# Altium project S6_FLHS_A2D-pcb-AW1.PrjPcb (part 3 of 3)

## Sheet Power-AW1.SchDoc
size E; SheetNumber: 2; SheetTotal: 5
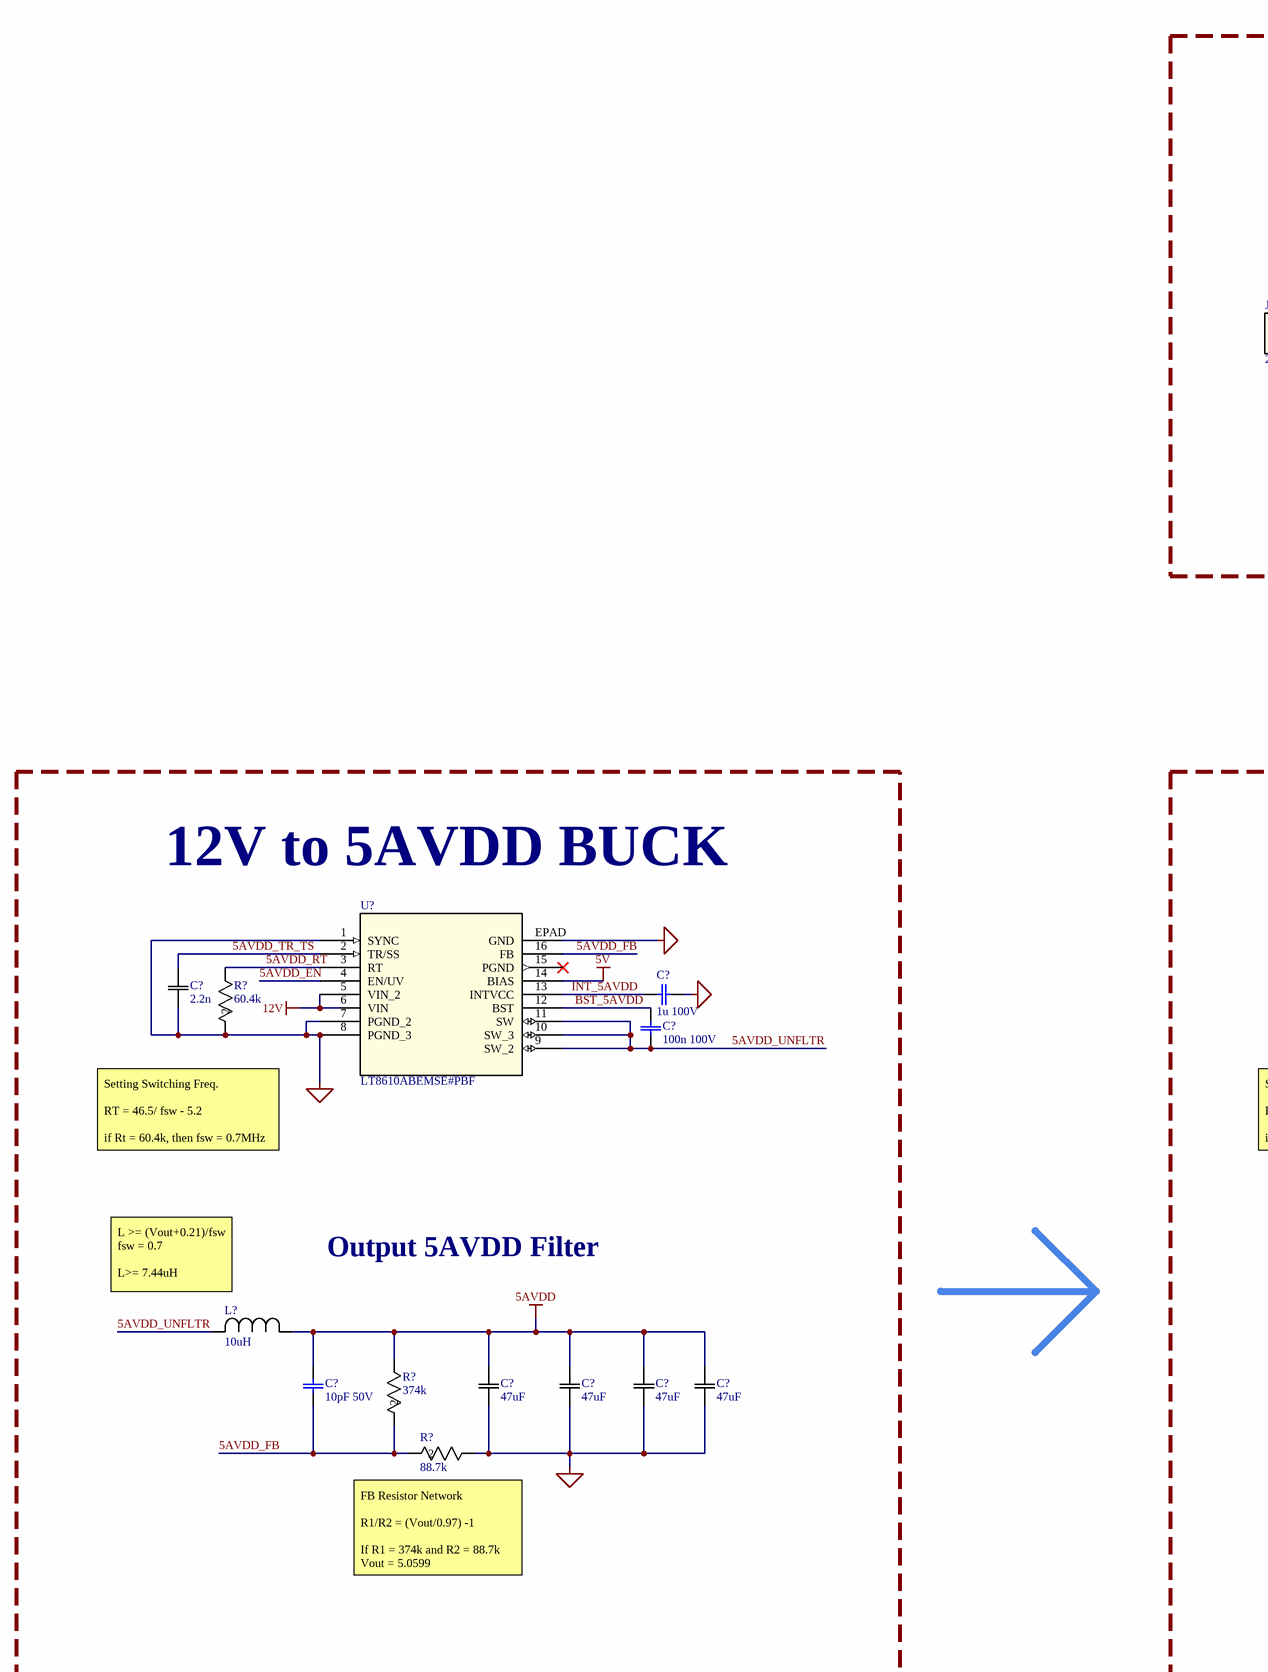
[diagram p3: Power-AW1.SchDoc, top middle]
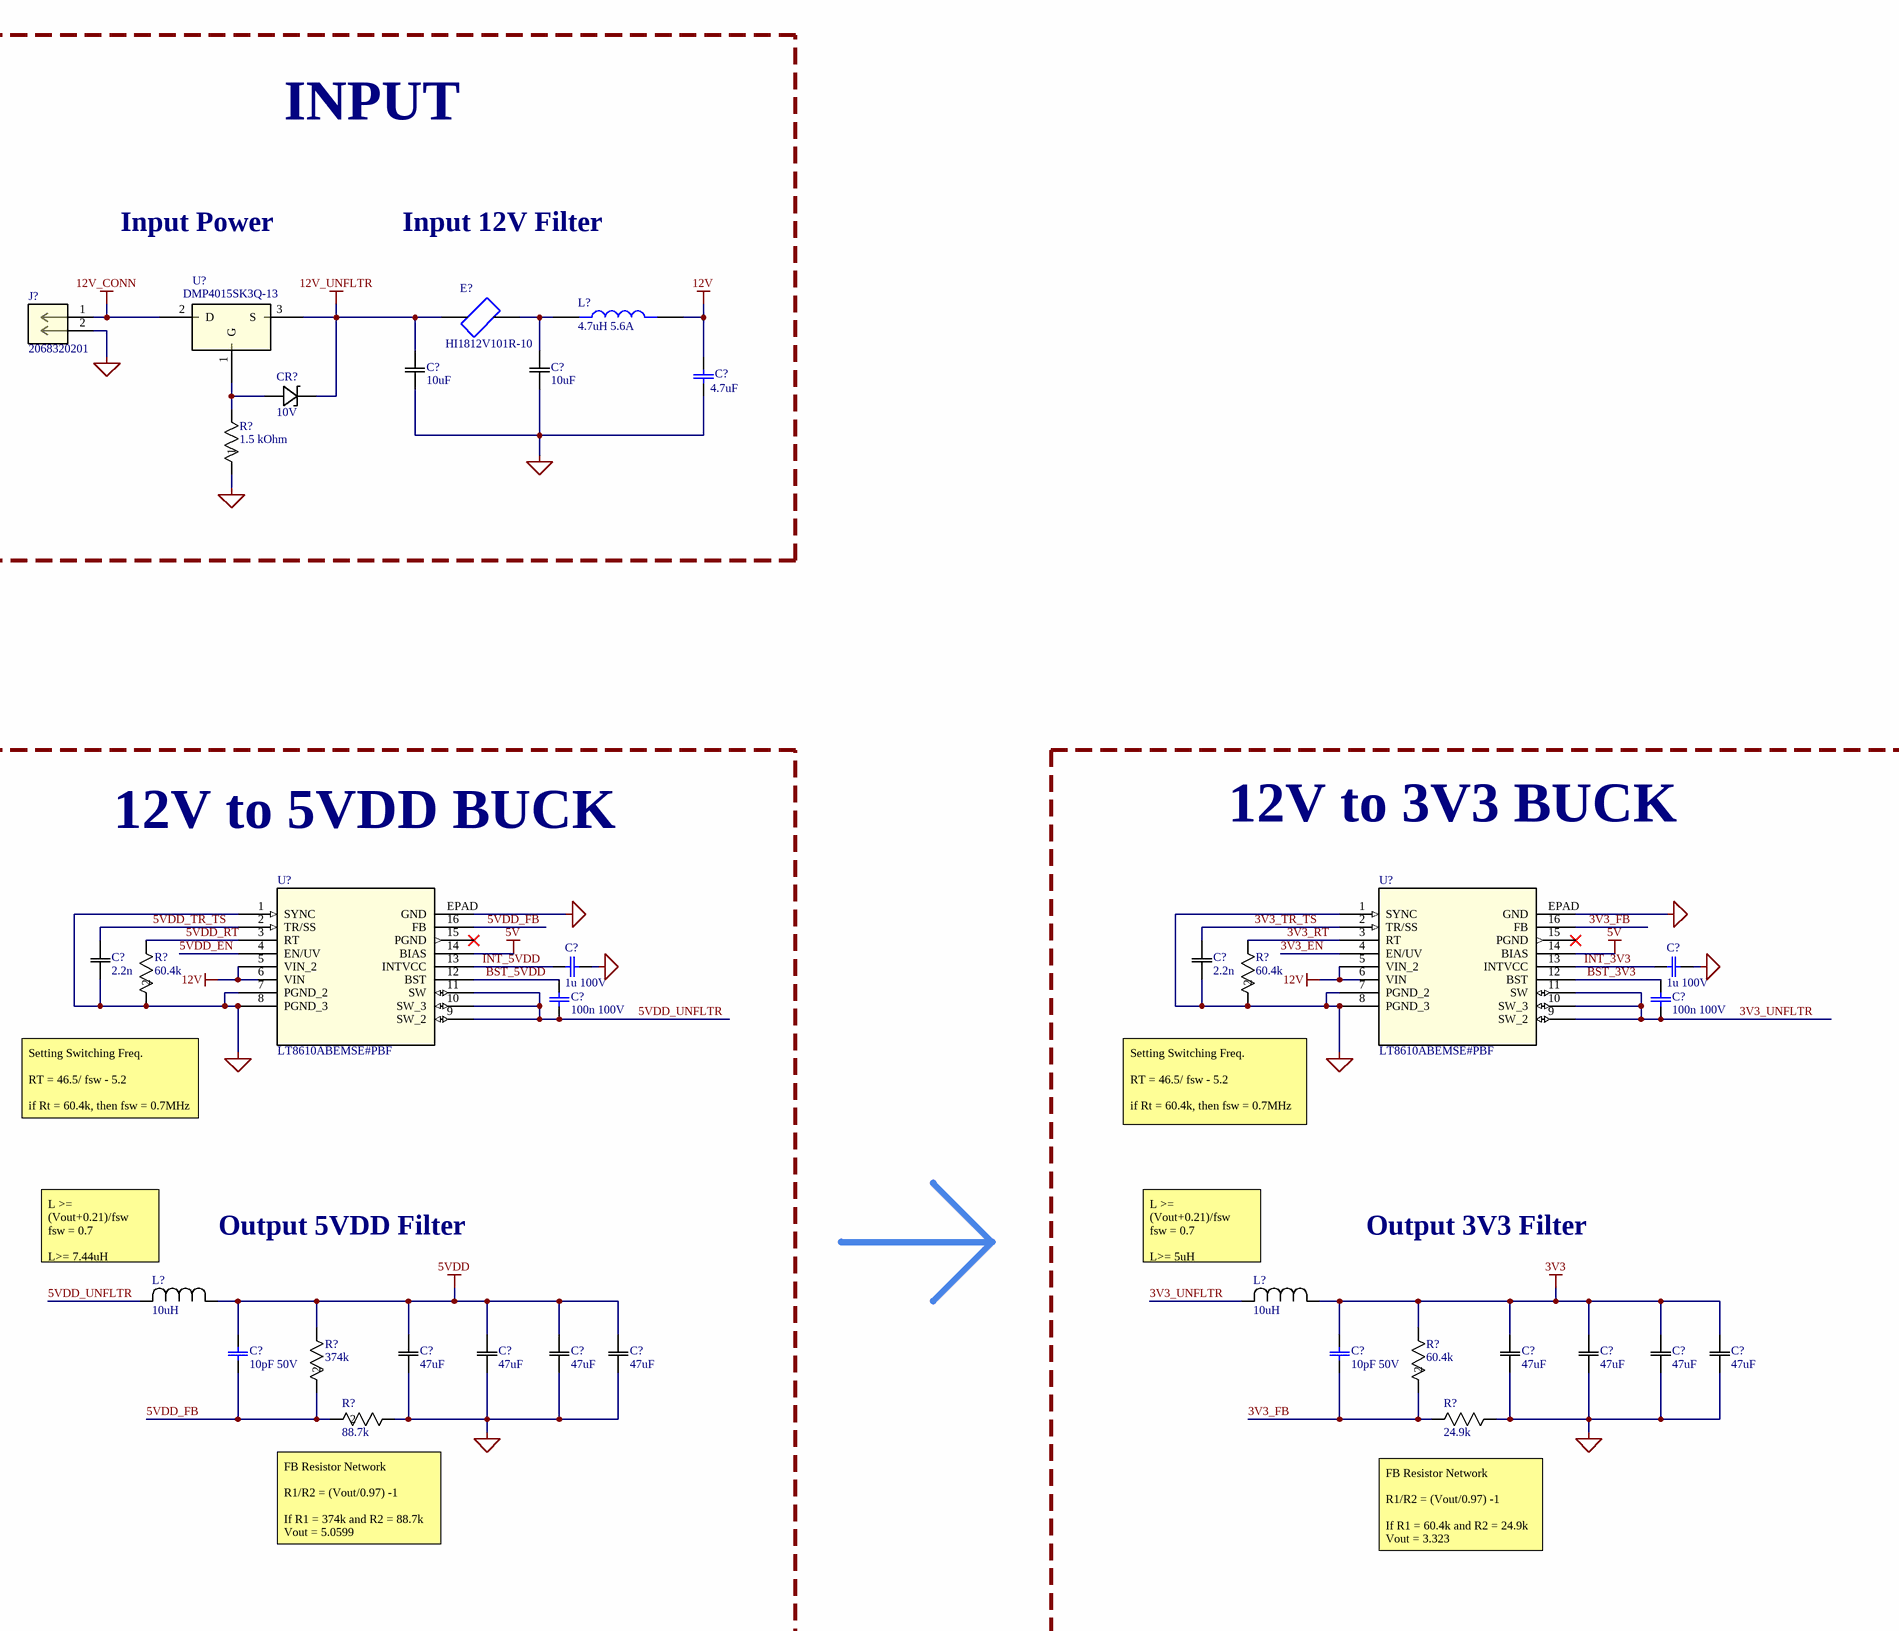
[diagram p4: Power-AW1.SchDoc, top right]
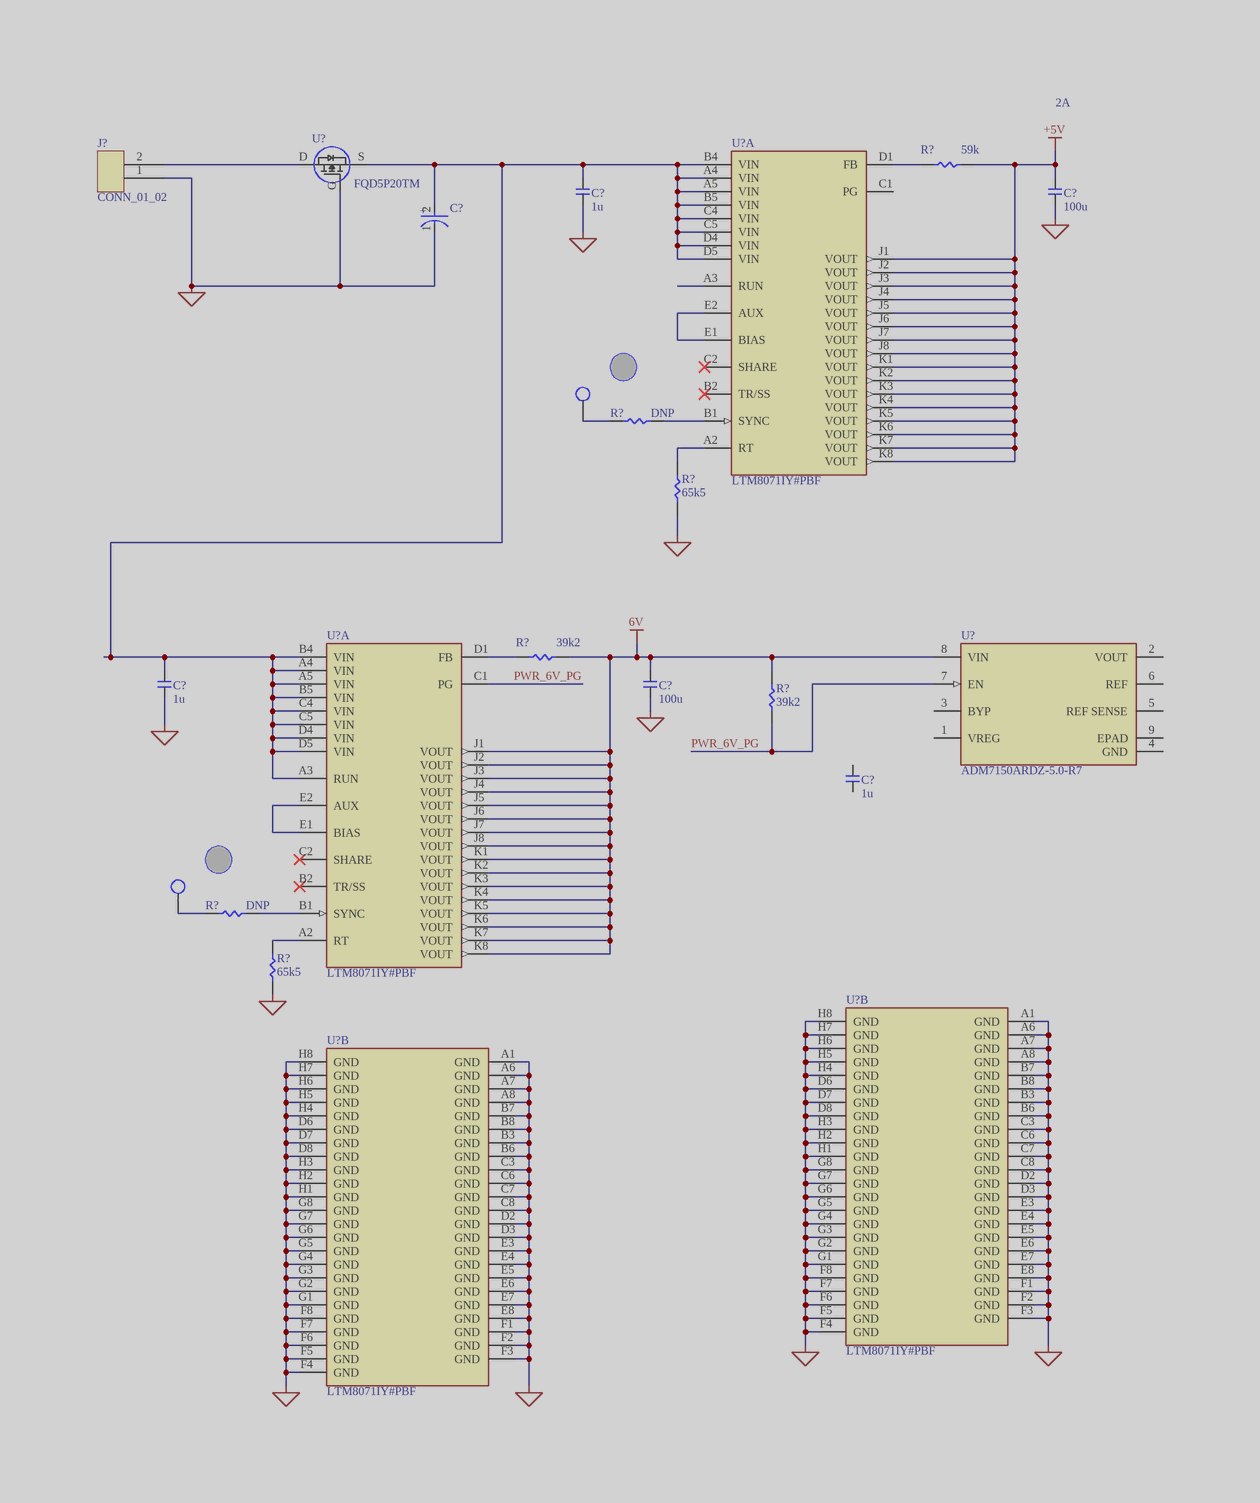
[diagram p5: Power-AW1.SchDoc, bottom left]
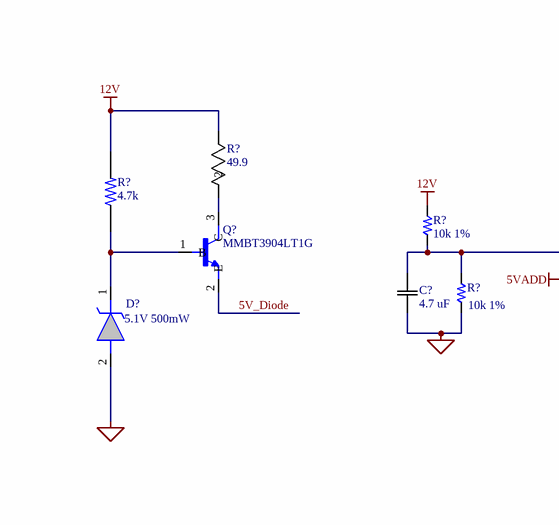
[diagram p6: Power-AW1.SchDoc, bottom middle]
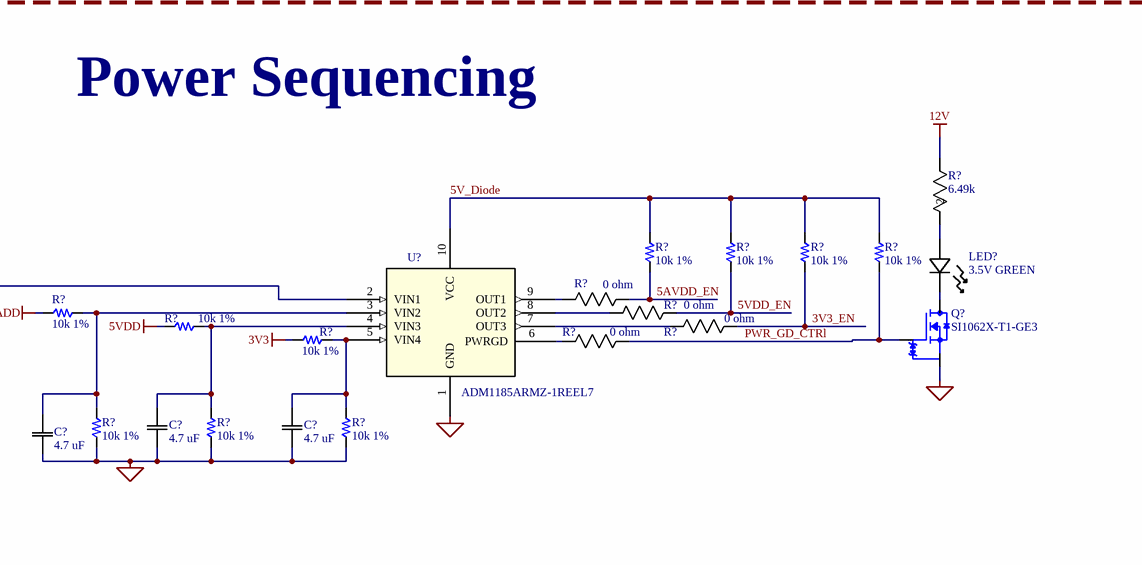
[diagram p7: Power-AW1.SchDoc, bottom right]

### Parts
(Parts that share a designator on the sheet are numbered #1, #2 ... from top to bottom, then left to right.)
C?#1  10uF  [CAP_C225-1210_TDK]
C?#2  10uF  [CAP_C225-1210_TDK]
C?#3  CL31B475KBHVPNE  [CL31B475KBHVPNE]  (value not drawn)
C?#4  1u 100V  [CL31B105KCHNNNE]
C?#5  1u 100V  [CL31B105KCHNNNE]
C?#6  1u 100V  [CL31B105KCHNNNE]
C?#7  2.2n  [CAP_CL21_SAM]
C?#8  2.2n  [CAP_CL21_SAM]
C?#9  2.2n  [CAP_CL21_SAM]
C?#10  100n 100V  [CL31B104KCFNNNE]
C?#11  100n 100V  [CL31B104KCFNNNE]
C?#12  100n 100V  [CL31B104KCFNNNE]
C?#13  10pF 50V  [CL10C100CB81PNC]
C?#14  47uF  [CAP_CL32B_SAM]
C?#15  47uF  [CAP_CL32B_SAM]
C?#16  47uF  [CAP_CL32B_SAM]
C?#17  47uF  [CAP_CL32B_SAM]
C?#18  10pF 50V  [CL10C100CB81PNC]
C?#19  47uF  [CAP_CL32B_SAM]
C?#20  47uF  [CAP_CL32B_SAM]
C?#21  47uF  [CAP_CL32B_SAM]
C?#22  47uF  [CAP_CL32B_SAM]
C?#23  10pF 50V  [CL10C100CB81PNC]
C?#24  47uF  [CAP_CL32B_SAM]
C?#25  47uF  [CAP_CL32B_SAM]
C?#26  47uF  [CAP_CL32B_SAM]
C?#27  47uF  [CAP_CL32B_SAM]
C?#28  1u  [CAP_1206]  (masked out: inside a compile mask, not in the netlist)
C?#29  100u  [CAP_1206]  (masked out: inside a compile mask, not in the netlist)
C?#30  T521X107M025ATE060  [FP-T521X-MFG]  (value not drawn)  (masked out: inside a compile mask, not in the netlist)
C?#31  4.7 uF  [CAP_GRM188D_MUR]
C?#32  4.7 uF  [CAP_GRM188D_MUR]
C?#33  4.7 uF  [CAP_GRM188D_MUR]
C?#34  1u  [CAP_1206]  (masked out: inside a compile mask, not in the netlist)
C?#35  100u  [CAP_1206]  (masked out: inside a compile mask, not in the netlist)
C?#36  4.7 uF  [CAP_GRM188D_MUR]
C?#37  1u  [CAP_1206]  (masked out: inside a compile mask, not in the netlist)
CR?  10V  [ZDO_SOF523_BZT52C_DIO-M]
D?  5.1V 500mW  [SOD3716X145N]
E?  HI1812V101R-10  [FB_HI1812V101R-10]
J?#1  2068320201  [CONN_2068320000-SD_02_MOL]
J?#2  CONN_01_02  (masked out: inside a compile mask, not in the netlist)
L?#1  4.7uH 5.6A  [IND_SPM6530T-4R7M]
L?#2  10uH  [IND_IHLP_2525_CZ_VIS]
L?#3  10uH  [IND_IHLP_2525_CZ_VIS]
L?#4  10uH  [IND_IHLP_2525_CZ_VIS]
LED?  3.5V GREEN  [Lite_on_LED]
Q?#1  MMBT3904LT1G  [SOT95P240X111-3N]
Q?#2  SI1062X-T1-GE3  [SOT50P160X80-3N]
R?#1  1.5 kOhm  [RES_CRCW0402_VIS-m]
R?#2  60.4k  [RC0805N_YAG]
R?#3  60.4k  [RC0805N_YAG]
R?#4  60.4k  [RC0805N_YAG]
R?#5  374k  [RC0805N_YAG]
R?#6  374k  [RC0805N_YAG]
R?#7  60.4k  [RC0805N_YAG]
R?#8  88.7k  [RC0805N_YAG]
R?#9  88.7k  [RC0805N_YAG]
R?#10  24.9k  [RC0603N_YAG-M]
R?#11  59k  [RES_0402]  (masked out: inside a compile mask, not in the netlist)
R?#12  DNP  [RES_0402]  (net tie, no BOM)  (masked out: inside a compile mask, not in the netlist)
R?#13  4.7k  [RESC1607X60N]
R?#14  6.49k  [RC0603N_PAN-M]
R?#15  49.9  [RC0603N_PAN-M]
R?#16  65k5  [RES_0402]  (masked out: inside a compile mask, not in the netlist)
R?#17  value 10k 1%  [ERJ-3EKF1002V]  (hidden comment: ERJ-3EKF1002V)
R?#18  value 10k 1%  [ERJ-3EKF1002V]  (hidden comment: ERJ-3EKF1002V)
R?#19  value 10k 1%  [ERJ-3EKF1002V]  (hidden comment: ERJ-3EKF1002V)
R?#20  value 10k 1%  [ERJ-3EKF1002V]  (hidden comment: ERJ-3EKF1002V)
R?#21  value 10k 1%  [ERJ-3EKF1002V]  (hidden comment: ERJ-3EKF1002V)
R?#22  0 ohm  [RC0402N_PAN-M]
R?#23  value 10k 1%  [ERJ-3EKF1002V]  (hidden comment: ERJ-3EKF1002V)
R?#24  0 ohm  [RC0402N_PAN-M]
R?#25  value 10k 1%  [ERJ-3EKF1002V]  (hidden comment: ERJ-3EKF1002V)
R?#26  0 ohm  [RC0402N_PAN-M]
R?#27  value 10k 1%  [ERJ-3EKF1002V]  (hidden comment: ERJ-3EKF1002V)
R?#28  0 ohm  [RC0402N_PAN-M]
R?#29  value 10k 1%  [ERJ-3EKF1002V]  (hidden comment: ERJ-3EKF1002V)
R?#30  39k2  [RES_0402]  (masked out: inside a compile mask, not in the netlist)
R?#31  value 10k 1%  [ERJ-3EKF1002V]  (hidden comment: ERJ-3EKF1002V)
R?#32  value 10k 1%  [ERJ-3EKF1002V]  (hidden comment: ERJ-3EKF1002V)
R?#33  value 10k 1%  [ERJ-3EKF1002V]  (hidden comment: ERJ-3EKF1002V)
R?#34  39k2  [RES_0402]  (masked out: inside a compile mask, not in the netlist)
R?#35  DNP  [RES_0402]  (net tie, no BOM)  (masked out: inside a compile mask, not in the netlist)
R?#36  65k5  [RES_0402]  (masked out: inside a compile mask, not in the netlist)
TP?#1  TEST POINT  (value not drawn)  (masked out: inside a compile mask, not in the netlist)
TP?#2  TEST POINT  (value not drawn)  (masked out: inside a compile mask, not in the netlist)
U?#1  DMP4015SK3Q-13  [TO-252_DIO-L]
U?#2  LT8610ABEMSE#PBF  [MSOP16-E_MSE_ADI]
U?#3  LT8610ABEMSE#PBF  [MSOP16-E_MSE_ADI]
U?#4  LT8610ABEMSE#PBF  [MSOP16-E_MSE_ADI]
U?#5  FQD5P20TM  (masked out: inside a compile mask, not in the netlist)
U?#6  LTM8071IY#PBF  [FP-BGA-80-05-08-1997-MFG]  (part A of 2)  (masked out: inside a compile mask, not in the netlist)
U?#7  ADM1185ARMZ-1REEL7  [RM_10_ADI-m]
U?#8  LTM8071IY#PBF  [FP-BGA-80-05-08-1997-MFG]  (part A of 2)  (masked out: inside a compile mask, not in the netlist)
U?#9  ADM7150ARDZ-5.0-R7  [FP-RD-8-2-IPC_A]  (masked out: inside a compile mask, not in the netlist)
U?#10  LTM8071IY#PBF  [FP-BGA-80-05-08-1997-MFG]  (part B of 2)  (masked out: inside a compile mask, not in the netlist)
U?#11  LTM8071IY#PBF  [FP-BGA-80-05-08-1997-MFG]  (part B of 2)  (masked out: inside a compile mask, not in the netlist)

### Blocks framed on the sheet
INPUT: C?#1-C?#3 CR? E? J?#1 L?#1 R?#1 U?#1
12V to 5AVDD BUCK: C?#4 C?#7 C?#10 C?#13-C?#17 L?#2 R?#2 R?#5 R?#8 U?#2
12V to 5VDD BUCK: C?#5 C?#8 C?#11 C?#18-C?#22 L?#3 R?#3 R?#6 R?#9 U?#3
12V to 3V3 BUCK: C?#6 C?#9 C?#12 C?#23-C?#27 L?#4 R?#4 R?#7 R?#10 U?#4
Power Sequencing: C?#31-C?#33 C?#36 D? LED? Q?#1 Q?#2 R?#13-R?#15 R?#17-R?#29 R?#31-R?#33 U?#7

### Nets
3V3: C?#23.2 C?#24.2 C?#25.2 C?#26.2 C?#27.2 L?#4.1 R?#7.1 R?#27.2
5AVDD: C?#13.2 C?#14.2 C?#15.2 C?#16.2 C?#17.2 L?#2.1 R?#5.1
5V: U?#2.14(BIAS) U?#3.14(BIAS) U?#4.14(BIAS)
5VADD: R?#23.2
5VDD: C?#18.2 C?#19.2 C?#20.2 C?#21.2 C?#22.2 L?#3.1 R?#6.1 R?#25.2
12V: C?#3.2 L?#1.2 R?#13.2 R?#14.1 R?#15.1 R?#21.2 U?#2.5(VIN_2) U?#2.6(VIN) U?#3.5(VIN_2) U?#3.6(VIN) U?#4.5(VIN_2) U?#4.6(VIN)
12V_CONN: J?#1.1 U?#1.2(D)
12V_UNFLTR: C?#1.2 CR?.1 E?.1 U?#1.3(S)
GND: C?#1.1 C?#2.1 C?#3.1 C?#4.2 C?#5.2 C?#6.2 C?#7.1 C?#8.1 C?#9.1 C?#14.1 C?#15.1 C?#16.1 C?#17.1 C?#19.1 C?#20.1 C?#21.1 C?#22.1 C?#24.1 C?#25.1 C?#26.1 C?#27.1 C?#31.1 C?#32.1 C?#33.1 C?#36.1 D?.2(A) J?#1.2 Q?#2.2(S) R?#1.1 R?#2.2 R?#3.2 R?#4.2 R?#8.1 R?#9.1 R?#10.1 R?#29.1 R?#31.1 R?#32.1 R?#33.1 U?#2.1(SYNC) U?#2.7(PGND_2) U?#2.8(PGND_3) U?#2.EPAD(GND) U?#3.1(SYNC) U?#3.7(PGND_2) U?#3.8(PGND_3) U?#3.EPAD(GND) U?#4.1(SYNC) U?#4.7(PGND_2) U?#4.8(PGND_3) U?#4.EPAD(GND) U?#7.1(GND)
3V3_EN: R?#19.1 R?#26.1 U?#4.4(EN/UV)
3V3_FB: C?#23.1 R?#7.2 R?#10.2 U?#4.16(FB)
3V3_RT: R?#4.1 U?#4.3(RT)
3V3_TR_TS: C?#9.2 U?#4.2(TR/SS)
3V3_UNFLTR: C?#12.1 L?#4.2 U?#4.9(SW_2) U?#4.10(SW_3) U?#4.11(SW)
5AVDD_EN: R?#17.1 R?#22.1 U?#2.4(EN/UV)
5AVDD_FB: C?#13.1 R?#5.2 R?#8.2 U?#2.16(FB)
5AVDD_RT: R?#2.1 U?#2.3(RT)
5AVDD_TR_TS: C?#7.2 U?#2.2(TR/SS)
5AVDD_UNFLTR: C?#10.1 L?#2.2 U?#2.9(SW_2) U?#2.10(SW_3) U?#2.11(SW)
5V_Diode: Q?#1.2(E) R?#17.2 R?#18.2 R?#19.2 R?#20.2 U?#7.10(VCC)
5VDD_EN: R?#18.1 R?#24.1 U?#3.4(EN/UV)
5VDD_FB: C?#18.1 R?#6.2 R?#9.2 U?#3.16(FB)
5VDD_RT: R?#3.1 U?#3.3(RT)
5VDD_TR_TS: C?#8.2 U?#3.2(TR/SS)
5VDD_UNFLTR: C?#11.1 L?#3.2 U?#3.9(SW_2) U?#3.10(SW_3) U?#3.11(SW)
BST_3V3: C?#12.2 U?#4.12(BST)
BST_5AVDD: C?#10.2 U?#2.12(BST)
BST_5VDD: C?#11.2 U?#3.12(BST)
INT_3V3: C?#6.1 U?#4.13(INTVCC)
INT_5AVDD: C?#4.1 U?#2.13(INTVCC)
INT_5VDD: C?#5.1 U?#3.13(INTVCC)
PWR_GD_CTRl: Q?#2.1(G) R?#20.1 R?#28.1
NetC?#2_2: C?#2.2 E?.2 L?#1.1
NetC?#31_2: C?#31.2 R?#21.1 R?#29.2 U?#7.2(VIN1)
NetC?#32_2: C?#32.2 R?#25.1 R?#32.2 U?#7.4(VIN3)
NetC?#33_2: C?#33.2 R?#27.1 R?#33.2 U?#7.5(VIN4)
NetC?#36_2: C?#36.2 R?#23.1 R?#31.2 U?#7.3(VIN2)
NetCR?_2: CR?.2 R?#1.2 U?#1.1(G)
NetD?_1: D?.1(K) Q?#1.1(B) R?#13.1
NetLED?_1: LED?.1 Q?#2.3(D)
NetLED?_2: LED?.2 R?#14.2
NetQ?#1_3: Q?#1.3(C) R?#15.2
NetR?#22_2: R?#22.2 U?#7.9(OUT1)
NetR?#24_2: R?#24.2 U?#7.8(OUT2)
NetR?#26_2: R?#26.2 U?#7.7(OUT3)
NetR?#28_2: R?#28.2 U?#7.6(PWRGD)

Not connected (* = marked no-connect by the designer): U?#2 15(PGND)*; U?#3 15(PGND)*; U?#4 15(PGND)*

### Notes on the sheet
- Input Power
- Input 12V Filter
- (near C?#3) 4.7uF
- Setting Switching Freq.
  RT = 46.5/ fsw - 5.2
  if Rt = 60.4k, then fsw = 0.7MHz
- Output 5AVDD Filter
- (near L?#2) L >= (Vout+0.21)/fsw
  fsw = 0.7
  L>= 7.44uH
- (near L?#3) L >= (Vout+0.21)/fsw
  fsw = 0.7
  L>= 7.44uH
- Output 5VDD Filter
- (near L?#4) L >= (Vout+0.21)/fsw
  fsw = 0.7
  L>= 5uH
- Output 3V3 Filter
- (near R?#8) FB Resistor Network
  R1/R2 = (Vout/0.97) -1
  If R1 = 374k and R2 = 88.7k
  Vout = 5.0599
- (near R?#9) FB Resistor Network
  R1/R2 = (Vout/0.97) -1
  If R1 = 374k and R2 = 88.7k
  Vout = 5.0599
- (near R?#10) FB Resistor Network
  R1/R2 = (Vout/0.97) -1
  If R1 = 60.4k and R2 = 24.9k
  Vout = 3.323
- 2A
- (in symbol CMP-03017-000004-1) +

### Library data of the parts
C?#1 C?#2 = C3225X7R1N106K250AC: Multilayer Ceramic Capacitor, 10 uF, 75 V, ï¿½ 10%, X7R, 1210 [3225 Metric]; Mfr_Name: TDK; Type: Ceramic Capacitors; Vendor: Mouser; Vendor PN: 810-C3225X7R1N106K25; Manufacturer: TDK; Manufacturer PN: C3225X7R1N106K250AC
C?#3 = CL31B475KBHVPNE: CAP CER 4.7UF 50V X7R 1206; Manufacturer: Samsung Electro-Mechanics; Vendor: DigiKey; Vendor PN: 1276-6781-1-ND; Manufacturer PN: CL31B475KBHVPNE; Value: 4.7uF 50V
C?#4-C?#6 = CL31B105KCHNNNE: CAP CER 1UF 100V X7R 1206; Manufacturer: Samsung Electro-Mechanics; Vendor: DigiKey; Vendor PN: 1276-1838-1-ND; Manufacturer PN: CL31B105KCHNNNE
C?#7-C?#9 = CL21B222JBANNNC: Cap Ceramic 0.0022uF 50V X7R 5% SMD 0805 125°C Paper T/R; Mfr_Name: Samsung; Vendor: Digikey; Vendor PN: 1276-2478-2-ND; Manufacturer: Samsung; Manufacturer PN: CL21B222JBANNNC
C?#10-C?#12 = CL31B104KCFNNNE: CAP CER 0.1UF 100V X7R 1206; Manufacturer: Samsung Electro-Mechanics; Vendor: DigiKey; Vendor PN: 1276-1151-1-ND; Manufacturer PN: CL31B104KCFNNNE
C?#13 C?#18 C?#23 = CL10C100CB81PNC: CAP CER 10PF 50V C0G/NP0 0603; Manufacturer: Samsung Electro-Mechanics; Vendor: DigiKey; Vendor PN: 1276-2149-1-ND; Manufacturer PN: CL10C100CB81PNC; Value: 10pF 50V
C?#14-C?#17 C?#19-C?#22 C?#24-C?#27 = CL32B476KPJNNWE: Ceramic Capacitor, 47 uF, 10 V, 10%, X7R, 1210 [3225 Metric]; Mfr_Name: Samsung; Vendor: Digikey; Vendor PN: 1276-CL32B476KPJNNWETR-ND; Manufacturer: Samsung; Manufacturer PN: CL32B476KPJNNWE
C?#28 C?#34 C?#37 = CAP_1206: 1u X7R 1206 100V; Tolerance: *; Voltage Rating: *; Manufacturer: *; Part Number: *
C?#29 C?#35 = CAP_1206: 100u X7R 6V3; Tolerance: *; Voltage Rating: *; Manufacturer: *; Part Number: *
C?#30 = CMP-03017-000004-1: CAP TANT POLY 100UF 25V 2917; Polarity: Polar; Tolerance: 20%; Life (Hours): 2000Hour; ESR (Equivalent Series Resistance): 60mR; Dissipation Factor: 10%; Voltage Rating (DC): 25V; Features: General Purpose; Length: 7.3mm; Case/Package: 2917; Max Operating Temperature: 105°C; Construction: Flat; Capacitance: 100uF; Min Operating Temperature: -55°C; Package Quantity: 1; RoHS Compliant: Yes; Height: 4mm; Depth: 4.3mm; REACH SVHC: No SVHC; Termination: SMD/SMT; Width: 4.3mm; Case Code (Metric): 7343; Height - Seated (Max): 0.169inch; Case Code (Imperial): 2917; Radiation Hardening: No; Voltage Rating: 25V; Mount: Surface Mount; Packaging: Tape and Reel; Series: KO-CAP T521
C?#31-C?#33 C?#36 = GRM188Z71A475KE15D: CAP CER 4.7UF 10V X7R 0603; Manufacturer: Murata; Vendor: Digikey; Vendor PN: 490-GRM188Z71A475KE15DTR-ND; Manufacturer PN: GRM188Z71A475KE15D
CR? = BZT52C10T-7: Zener Diode 10 V 300 mW ±6% Surface Mount SOD-523; Manufacturer: Diodes Inc; Vendor: Digikey; Vendor PN: BZT52C10T-7DITR-ND; Manufacturer PN: BZT52C10T-7; ComponentLink1Description: New link; ComponentLink1URL: *
D? = DDZ9689-7: Diodes Inc Zener Diode, 5.1V 5% 500 mW SMT 2-Pin SOD-123; Manufacturer: Diodes Incorporated; Geometry.Height: 1.45mm; Vendor: Digikey; Vendor PN: DDZ9689DITR-ND; Manufacturer PN: DDZ9689-7; Mouser Part Number: 621-DDZ9689-7; Mouser Price/Stock: https://www.mouser.co.uk/ProductDetail/Diodes-Incorporated/DDZ9689-7?qs=SSucg2PyLi7sQf5CygBDiA%3D%3D; Arrow Part Number: DDZ9689-7; Arrow Price/Stock: https://www.arrow.com/en/products/ddz9689-7/diodes-incorporated?utm_currency=USD&region=nac; Datasheet Link: https://www.diodes.com//assets/Datasheets/ds30410.pdf
E? = HI1812V101R-10: 100 Ohms @ 100 MHz 1 Power, Signal Line Ferrite Bead 1812 (4532 Metric) 8A 10mOhm; Manufacturer: Laird-Signal Integrity Products; MF: Laird-Signal Integrity; Vendor: Digikey; Vendor PN: 240-2543-2-ND; SnapEDA_Link: https://www.snapeda.com/parts/HI1812V101R-10/Laird-Signal+Integrity+Products/view-part/?ref=snap; Package: 1812 Laird; Value: *; MP: HI1812V101R-10; Check_prices: https://www.snapeda.com/parts/HI1812V101R-10/Laird-Signal+Integrity+Products/view-part/?ref=eda; Manufacturer PN: HI1812V101R-10
J?#1 = 2068320201: Micro-fit+ Connector Header Through Hole 2 position Vertical; Manufacturer: Molex Connector Corporation; Vendor: Digikey; Vendor PN: WM26554-ND; RefDes: RefDes; Type: Type; Manufacturer PN: 2068320201
L?#1 = SPM6530T-4R7M: 4.7 ÂµH Shielded Drum Core, Wirewound Inductor 5.6 A 39.4mOhm Max Nonstandard; Manufacturer: TDK; Vendor PN: 445-4120-2-ND; Vendor: Digikey; Availability: In Stock; Value: *; Check_prices: https://www.snapeda.com/parts/SPM6530T-4R7M/TDK/view-part/?ref=eda; Package: NON STANDARD-2 TDK; Price: None; SnapEDA_Link: https://www.snapeda.com/parts/SPM6530T-4R7M/TDK/view-part/?ref=snap; Purchase-URL: https://pricing.snapeda.com/search/part/SPM6530T-4R7M/?ref=eda; Manufacturer PN: SPM6530T-4R7M
L?#2-L?#4 = IHLP2525CZER100M11: Power Inductors - SMD 10uH 20%; Mfr_Name: Vishay; Manufacturer: Vishay Dale; Vendor: Digikey; Vendor PN: 541-2577-2-ND; Manufacturer PN: IHLP2525CZER100M11
LED? = LTL2R3TGK: Single Color LEDs Green Clear 525nm; Manufacturer: LITE-ON; Vendor: Mouser; Vendor PN: 859-LTL2R3TGK; Manufacturer PN: LTL2R3TGK
Q?#1 = MMBT3904LT1G: Transistor, Bipolar,Si,NPN,General Purpose,VCEO 40VDC,IC 200mA,PD 225mW,SOT-23 | ON Semiconductor MMBT3904LT1G; Vendor: Digikey; Vendor PN: MMBT3904LT1GOSTR-ND; SnapEDA_Link: https://www.snapeda.com/parts/MMBT3904LT1G/Onsemi/view-part/?ref=snap; Package: SOT-23-3 ON Semiconductor; Value: *; Manufacturer: ON Semiconductor; Manufacturer PN: MMBT3904LT1G; Check_prices: https://www.snapeda.com/parts/MMBT3904LT1G/Onsemi/view-part/?ref=eda
Q?#2 = SI1062X-T1-GE3: SI1062X-T1-GE3 N-channel MOSFET Transistor, 0.53 A, 20 V, 3-Pin SC-89 | Siliconix / Vishay SI1062X-T1-GE3; Vendor: Digikey; Vendor PN: SI1062X-T1-GE3TR-ND; SnapEDA_Link: https://www.snapeda.com/parts/SI1062X-T1-GE3/Vishay+Siliconix/view-part/?ref=snap; Package: SOT-490 Vishay; Value: *; Manufacturer: Vishay; Manufacturer PN: SI1062X-T1-GE3; Check_prices: https://www.snapeda.com/parts/SI1062X-T1-GE3/Vishay+Siliconix/view-part/?ref=eda
R?#1 = CRCW04021K50FKEDC: RES 1.5K OHM 1% 1/16W 0402; Manufacturer: Vishay; Vendor: Digikey; Vendor PN: 541-4782-2-ND; Type: Chip Resistor - Surface Mount; Manufacturer PN: CRCW04021K50FKEDC
R?#2-R?#4 R?#7 = RT0805FRE0760K4L: Res 60.4k 0805; Mfr_Name: Yageo; Vendor: Digikey; Vendor PN: 13-RT0805FRE0760K4LTR-ND; Manufacturer: Yageo; Manufacturer PN: RT0805FRE0760K4L
R?#5 R?#6 = RC0805FR-07374KL: Res Thick Film 0805 374K Ohm 1% 0.125W(1/8W) ±100ppm/C Pad SMD T/R; Mfr_Name: Yageo; Vendor: Digikey; Vendor PN: 311-374KCRTR-ND; Manufacturer: Yageo; Manufacturer PN: RC0805FR-07374KL
R?#8 R?#9 = RC0805FR-0788K7L: SMD Chip Resistor, 88.7 kOhm, ï¿½ 1%, 125 mW, 0805 [2012 Metric]; Mfr_Name: Yageo; Vendor: Digikey; Vendor PN: 311-88.7KCRTR-ND; Manufacturer: Yageo; Manufacturer PN: RC0805FR-0788K7L
R?#10 = RC0603FR-0724K9L: RES 24.9K OHM 1% 1/10W 0603; Manufacturer: Yageo; Vendor: Digikey; Vendor PN: 311-24.9KHRTR-ND; Copyright: Copyright (C) 2025 Ultra Librarian. All rights reserved.; Manufacturer PN: RC0603FR-0724K9L
R?#11 R?#12 R?#16 R?#30 R?#34-R?#36 = RES_0402: RES SMD 0402; Manufacturer: *; Part Number: *; Power Rating: *
R?#13 = RC0603FR-074K7L: 4.7 kOhms ±1% 0.1W, 1/10W Chip Resistor 0603 (1608 Metric) Moisture Resistant Thick Film; Manufacturer: Yageo; Vendor: Digikey; Vendor PN: 311-4.70KHRTR-ND; Package: None; Price: None; Value: *; Manufacturer PN: RC0603FR-074K7L; Availability: Unavailable
R?#14 = ERJ-3EKF6491V: RES SMD 6.49K OHM 1% 1/10W 0603; Manufacturer: Panasonic; Vendor: Digikey; Vendor PN: P6.49KHTR-ND; Manufacturer PN: ERJ-3EKF6491V
R?#15 = ERJ-3EKF49R9V: 49.9 Ohms ±1% 0.1W, 1/10W Chip Resistor 0603 (1608 Metric) Automotive AEC-Q200 Thick Film; Manufacturer: Panasonic; Vendor: Digikey; Vendor PN: P49.9HTR-ND; Manufacturer PN: ERJ-3EKF49R9V
R?#17-R?#21 R?#23 R?#25 R?#27 R?#29 R?#31-R?#33 = ERJ-3EKF1002V: RES SMD 10K OHM 1% 1/10W 0603; Manufacturer: Panasonic Electronic Components; Vendor: DigiKey; Vendor PN: P10.0KHCT-ND; Manufacturer PN: ERJ-3EKF1002V
R?#22 R?#24 R?#26 R?#28 = ERJ-2GE0R00X: RES SMD 0 OHM JUMPER 1/10W 0402; Manufacturer: Panasonic; Vendor: Digikey; Vendor PN: P0.0JTR-ND; Manufacturer PN: ERJ-2GE0R00X
U?#1 = DMP4015SK3Q-13: P-Channel 40 V 11 mOhm 47.5 nC SMT Enhancement Mode Mosfet - TO-252; Mfr_Name: Diodes Inc; RefDes: RefDes; Type: Type
U?#2-U?#4 = LT8610ABEMSE#PBF: IC REG BUCK ADJ 3.5A 16MSOP; Mfr_Name: Analog Devices Inc; Vendor: Digikey; Vendor_PN: 505-LT8610ABEMSE#PBF-ND; Mfr_PN: LT8610ABEMSE#PBF
U?#5 = FQD5P20TM: P-CHANNEL MOSFET
U?#6 U?#8 U?#10 U?#11 = CMP-09139-000019-1: 60VIN, 5A SILENT SWITCHER M REG; Manufacturer: Analog Devices; Switching Frequency: 200-2200kHz; Output Current: 7.25A; Max Duty Cycle: 80%; Number Of Outputs: 1; Output Voltage: 0.97-15V; Min Supply Voltage: 3.6V; Max Supply Voltage: 60V; Output Type: AdjustableProgrammable; Max Junction Temp: +125°C; Switching Topology: Buck; Standoff Height: 0.4mm; Nominal Supply Current: 3-300uA; Automotive: No; Category: IC; Device Class L3: Voltage Regulators - Switching; ComponentLink2Description: Datasheet; Temperature Range High: +125°C; Temperature: -40°C to +125°C; Digikey Description: 60VIN, 5A SILENT SWITCHER M REG; Height: 3.52mm; Octopart: https://octopart.com/ltm8071iy%23pbf-analog+devices-96285090; ComponentLink2URL: https://www.analog.com/media/en/technical-documentation/data-sheets/LTM8071.pdf; Temperature Range Low: -40°C; Lead Free: Yes; RoHS: TRUE; Package: BGA-80-05-08-1997; Manufacturer Part Number: LTM8071IY#PBF; Device Class L1: Integrated Circuits (ICs); Device Class L2: Power Management ICs
U?#7 = ADM1185ARMZ-1REEL7: Quad Voltage Monitor and Sequencer; Manufacturer: Analog Devices Inc; Vendor: Digikey; Vendor PN: 505-ADM1185ARMZ-1REEL7TR-ND; Copyright: Copyright (C) 2025 Ultra Librarian. All rights reserved.; Manufacturer PN: ADM1185ARMZ-1REEL7; RefDes: RefDes; Type: Type
U?#9 = CMP-09138-000116-1: IC REG LINEAR 5V 800MA 8SOIC; Number of Regulators: 1; Operating Supply Current: 8.6mA; Dropout Voltage: 600mV; Max Input Voltage: 16V; Polarity: Positive; Min Current Limit: 1A; Accuracy: 1%; Quiescent Current: 7mA; Power Supply Rejection Ratio (PSRR): -86dB; Output Type: Fixed; Min Input Voltage: 4.5V; Output Current: 800mA; Weight: 0.019048oz; Output Voltage: 5V; Mount: Surface Mount; RoHS Compliant: Yes; Lead Free: Contains Lead; Contact Plating: Tin; Package Quantity: 1000; Number of Pins: 8; Case/Package: SOIC; Min Operating Temperature: -40°C; Max Output Current: 800mA; Max Operating Temperature: 125°C; Packaging: Tape and Reel; Number of Outputs: 1

## Sheet AI_CONN.SchDoc
size C portrait; SheetNumber: 5; SheetTotal: 5
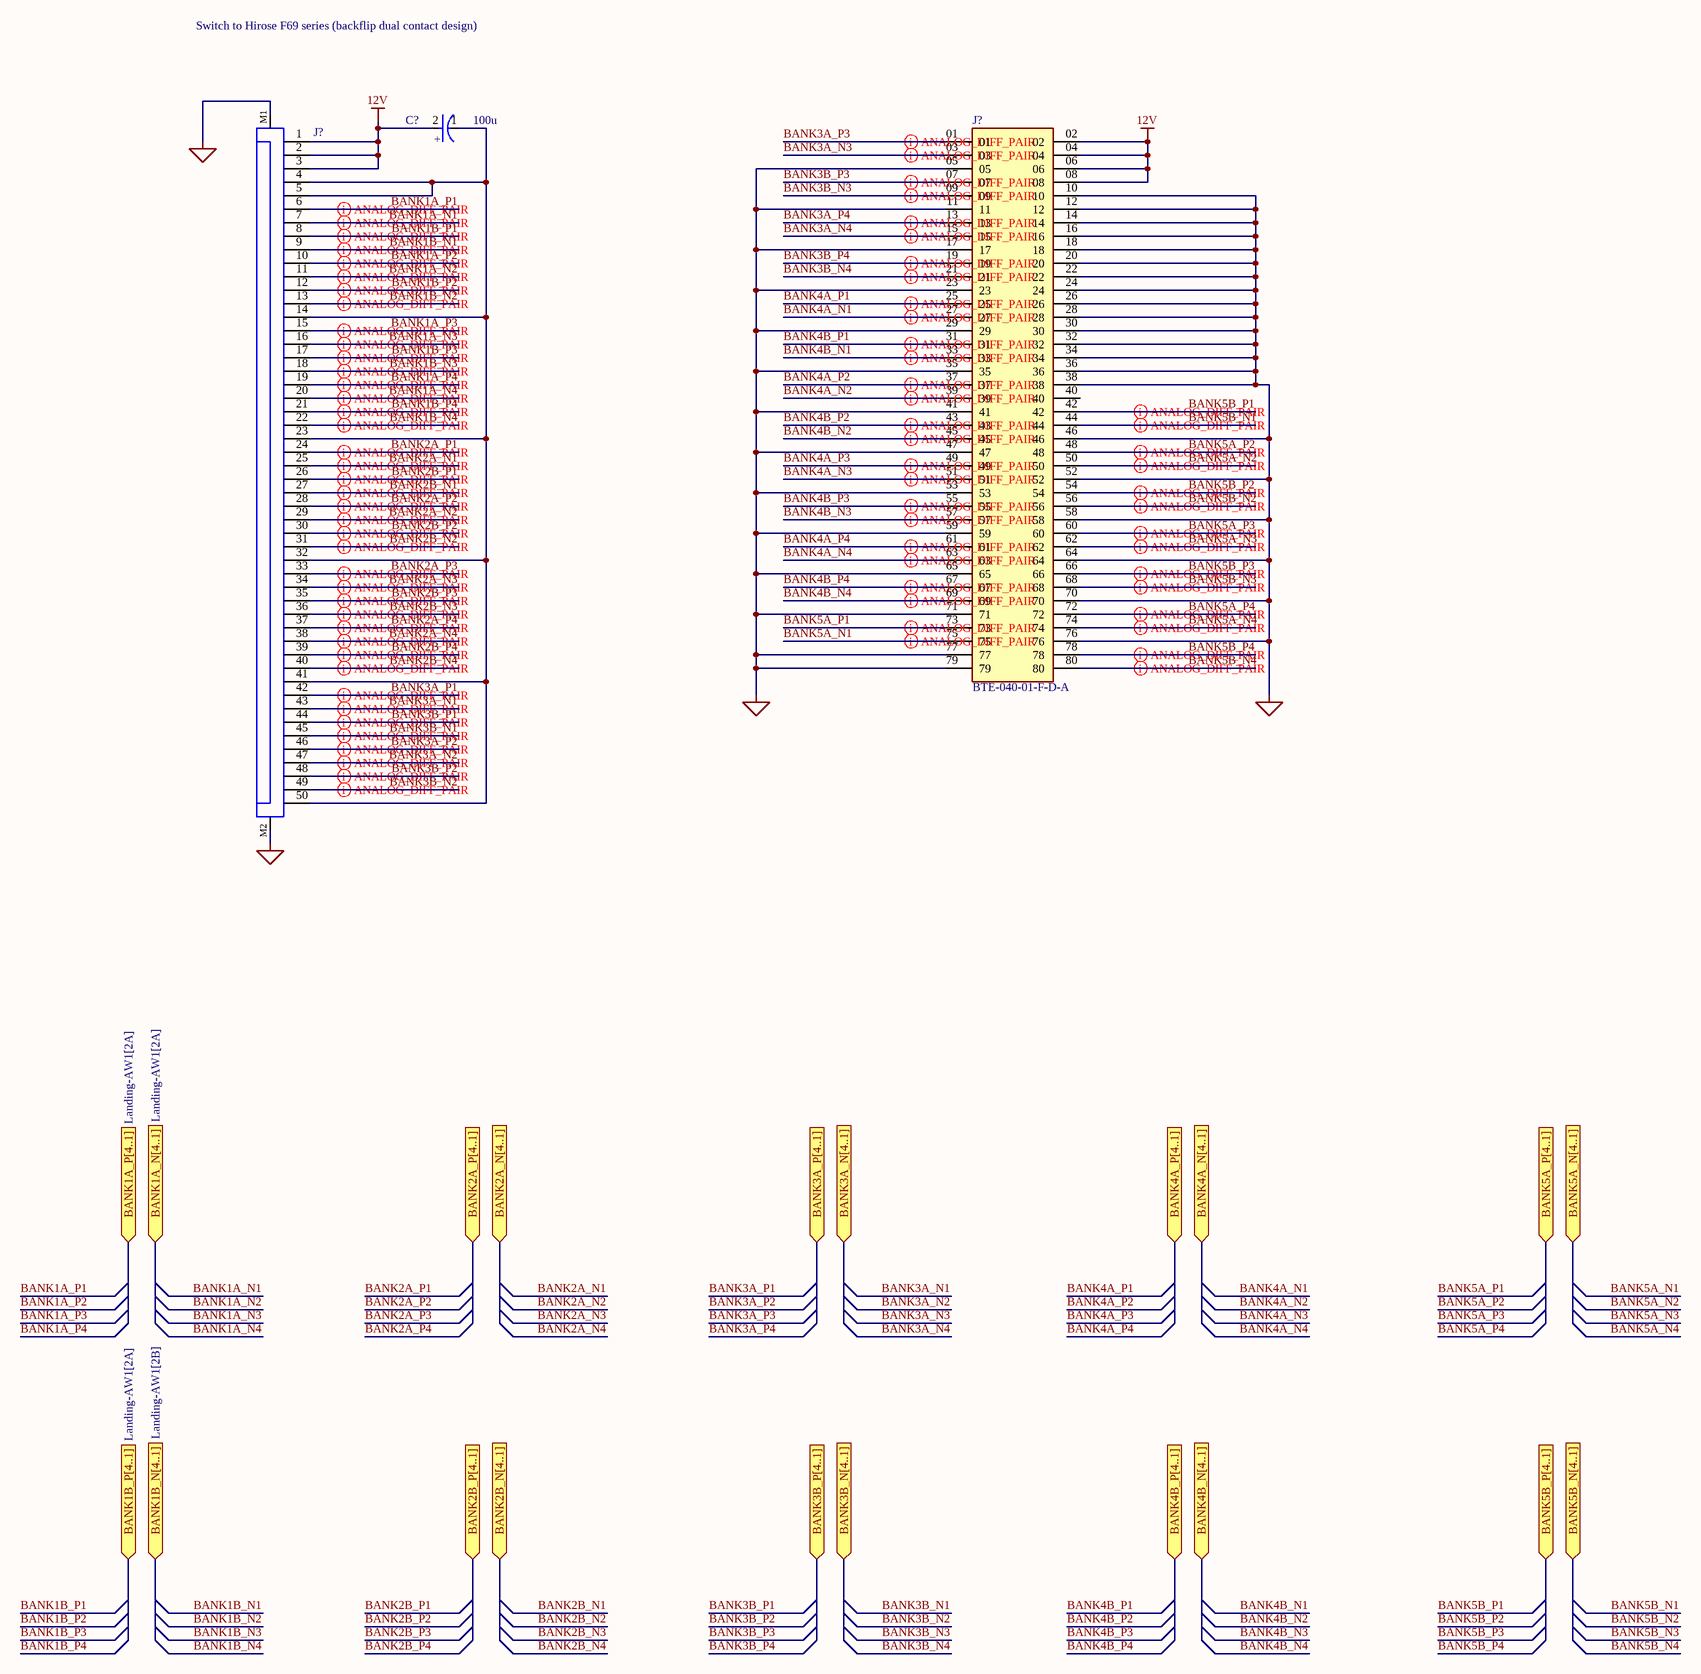
[diagram p8: AI_CONN.SchDoc]

### Parts
(Parts that share a designator on the sheet are numbered #1, #2 ... from top to bottom, then left to right.)
C?#38  100u  [FP-T521X-MFG]
J?#3  68715014522  [68715014522]  (value not drawn)
J?#4  BTE-040-01-F-D-A  [BTE-040]

### Ports
BANK1A_N[4..1] (in, see Landing-AW1[2A]), BANK1A_P[4..1] (in, see Landing-AW1[2A]), BANK1B_N[4..1] (in, see Landing-AW1[2B]), BANK1B_P[4..1] (in, see Landing-AW1[2A]), BANK2A_N[4..1] (in), BANK2A_P[4..1] (in), BANK2B_N[4..1] (in), BANK2B_P[4..1] (in), BANK3A_N[4..1] (in), BANK3A_P[4..1] (in), BANK3B_N[4..1] (in), BANK3B_P[4..1] (in), BANK4A_N[4..1] (in), BANK4A_P[4..1] (in), BANK4B_N[4..1] (in), BANK4B_P[4..1] (in), BANK5A_N[4..1] (in), BANK5A_P[4..1] (in), BANK5B_N[4..1] (in), BANK5B_P[4..1] (in)

### Nets
12V: C?#38.2(A) J?#3.1 J?#3.2 J?#3.3 J?#4.02 J?#4.04 J?#4.06 J?#4.08
GND: J?#3.M1 J?#3.M2 J?#4.05 J?#4.10 J?#4.11 J?#4.12 J?#4.14 J?#4.16 J?#4.17 J?#4.18 J?#4.20 J?#4.22 J?#4.23 J?#4.24 J?#4.26 J?#4.28 J?#4.29 J?#4.30 J?#4.32 J?#4.34 J?#4.35 J?#4.36 J?#4.38 J?#4.41 J?#4.46 J?#4.47 J?#4.52 J?#4.53 J?#4.58 J?#4.59 J?#4.64 J?#4.65 J?#4.70 J?#4.71 J?#4.76 J?#4.77 J?#4.79
BANK1A_N1: J?#3.7
BANK1A_N2: J?#3.11
BANK1A_N3: J?#3.16
BANK1A_N4: J?#3.20
BANK1A_P1: J?#3.6
BANK1A_P2: J?#3.10
BANK1A_P3: J?#3.15
BANK1A_P4: J?#3.19
BANK1B_N1: J?#3.9
BANK1B_N2: J?#3.13
BANK1B_N3: J?#3.18
BANK1B_N4: J?#3.22
BANK1B_P1: J?#3.8
BANK1B_P2: J?#3.12
BANK1B_P3: J?#3.17
BANK1B_P4: J?#3.21
BANK2A_N1: J?#3.25
BANK2A_N2: J?#3.29
BANK2A_N3: J?#3.34
BANK2A_N4: J?#3.38
BANK2A_P1: J?#3.24
BANK2A_P2: J?#3.28
BANK2A_P3: J?#3.33
BANK2A_P4: J?#3.37
BANK2B_N1: J?#3.27
BANK2B_N2: J?#3.31
BANK2B_N3: J?#3.36
BANK2B_N4: J?#3.40
BANK2B_P1: J?#3.26
BANK2B_P2: J?#3.30
BANK2B_P3: J?#3.35
BANK2B_P4: J?#3.39
BANK3A_N1: J?#3.43
BANK3A_N2: J?#3.47
BANK3A_N3: J?#4.03
BANK3A_N4: J?#4.15
BANK3A_P1: J?#3.42
BANK3A_P2: J?#3.46
BANK3A_P3: J?#4.01
BANK3A_P4: J?#4.13
BANK3B_N1: J?#3.45
BANK3B_N2: J?#3.49
BANK3B_N3: J?#4.09
BANK3B_N4: J?#4.21
BANK3B_P1: J?#3.44
BANK3B_P2: J?#3.48
BANK3B_P3: J?#4.07
BANK3B_P4: J?#4.19
BANK4A_N1: J?#4.27
BANK4A_N2: J?#4.39
BANK4A_N3: J?#4.51
BANK4A_N4: J?#4.63
BANK4A_P1: J?#4.25
BANK4A_P2: J?#4.37
BANK4A_P3: J?#4.49
BANK4A_P4: J?#4.61
BANK4B_N1: J?#4.33
BANK4B_N2: J?#4.45
BANK4B_N3: J?#4.57
BANK4B_N4: J?#4.69
BANK4B_P1: J?#4.31
BANK4B_P2: J?#4.43
BANK4B_P3: J?#4.55
BANK4B_P4: J?#4.67
BANK5A_N1: J?#4.75
BANK5A_N2: J?#4.50
BANK5A_N3: J?#4.62
BANK5A_N4: J?#4.74
BANK5A_P1: J?#4.73
BANK5A_P2: J?#4.48
BANK5A_P3: J?#4.60
BANK5A_P4: J?#4.72
BANK5B_N1: J?#4.44
BANK5B_N2: J?#4.56
BANK5B_N3: J?#4.68
BANK5B_N4: J?#4.80
BANK5B_P1: J?#4.42
BANK5B_P2: J?#4.54
BANK5B_P3: J?#4.66
BANK5B_P4: J?#4.78
NetC?#38_1: C?#38.1(C) J?#3.4 J?#3.5 J?#3.14 J?#3.23 J?#3.32 J?#3.41 J?#3.50

Not connected (* = marked no-connect by the designer): J?#4 40

### Layout directives
differential pair: BANK1A_N1, BANK1A_N2, BANK1A_N3, BANK1A_N4, BANK1A_P1, BANK1A_P2, BANK1A_P3, BANK1A_P4, BANK1B_N1, BANK1B_N2, BANK1B_N3, BANK1B_N4, BANK1B_P1, BANK1B_P2, BANK1B_P3, BANK1B_P4, BANK2A_N1, BANK2A_N2, BANK2A_N3, BANK2A_N4, BANK2A_P1, BANK2A_P2, BANK2A_P3, BANK2A_P4, BANK2B_N1, BANK2B_N2, BANK2B_N3, BANK2B_N4, BANK2B_P1, BANK2B_P2, BANK2B_P3, BANK2B_P4, BANK3A_N1, BANK3A_N2, BANK3A_N3, BANK3A_N4, BANK3A_P1, BANK3A_P2, BANK3A_P3, BANK3A_P4, BANK3B_N1, BANK3B_N2, BANK3B_N3, BANK3B_N4, BANK3B_P1, BANK3B_P2, BANK3B_P3, BANK3B_P4, BANK4A_N1, BANK4A_N2, BANK4A_N3, BANK4A_N4, BANK4A_P1, BANK4A_P2, BANK4A_P3, BANK4A_P4, BANK4B_N1, BANK4B_N2, BANK4B_N3, BANK4B_N4, BANK4B_P1, BANK4B_P2, BANK4B_P3, BANK4B_P4, BANK5A_N1, BANK5A_N2, BANK5A_N3, BANK5A_N4, BANK5A_P1, BANK5A_P2, BANK5A_P3, BANK5A_P4, BANK5B_N1, BANK5B_N2, BANK5B_N3, BANK5B_N4, BANK5B_P1, BANK5B_P2, BANK5B_P3, BANK5B_P4

### Notes on the sheet
- Switch to Hirose F69 series (backflip dual contact design)
- (in symbol CMP-03017-000004-1) +

### Library data of the parts
C?#38 = CMP-03017-000004-1: CAP TANT POLY 100UF 25V 2917 / T521X107M025ATE060; Polarity: Polar; Tolerance: 20%; Life (Hours): 2000Hour; ESR (Equivalent Series Resistance): 60mR; Dissipation Factor: 10%; Voltage Rating (DC): 25V; Features: General Purpose; Length: 7.3mm; Case/Package: 2917; Max Operating Temperature: 105°C; Construction: Flat; Capacitance: 100uF; Min Operating Temperature: -55°C; Package Quantity: 1; RoHS Compliant: Yes; Height: 4mm; Depth: 4.3mm; REACH SVHC: No SVHC; Termination: SMD/SMT; Width: 4.3mm; Case Code (Metric): 7343; Height - Seated (Max): 0.169inch; Case Code (Imperial): 2917; Radiation Hardening: No; Voltage Rating: 25V; Mount: Surface Mount; Packaging: Tape and Reel; Series: KO-CAP T521
J?#3 = 68715014522: WR-FPC SMT ZIF Horizontal Bottom Contact, pitch 0.5mm, Horizontal, 50pins; Manufacturer: Wurth Elektronik; Contact Resistance: 20mΩ; Rated Current: 0.5A; Working Voltage: 50VAC; ComponentLink1Description: Website Link; ComponentLink1URL: https://www.we-online.com/redexpert/article/68715014522?ad; ComponentLink2Description: Datasheet Link; ComponentLink2URL: https://www.we-online.com/redexpert/spec/68715014522?ad; Manufacturer Part Number: 68715014522; Category: FPC Connectors; Match Code: WR-FPC; Mount: Surface Mount; Operating Temperature Max: 85°C; Operating Temperature Min: -25°C; Packaging: Tape and Reel; Length: 31.4mm; Width: 5.1mm; Height: 2.1mm; Number of Pins: 50; Orientation: Horizontal; Pitch: 0.5mm
J?#4 = BTE-040-01-F-D-A: MF: Samtec; MP: BTE-040-01-F-D-A; Value: *; Package: None; Price: None; Availability: Unavailable

## Nets that join several sheets
3V3: U1_ADC (6 pins), Power-AW1 (8 pins), U2_ADC (6 pins), U3_ADC (6 pins), U4_ADC (6 pins), U5_ADC (6 pins)
5VA: U1_ADC/U_ADC_DRIVER1 (R?_U1_ADC_U_ADC_DRIVER1#1.1 U?_U1_ADC_U_ADC_DRIVER1#1.3), U1_ADC/U_ADC_DRIVER2 (R?_U1_ADC_U_ADC_DRIVER2#1.1 U?_U1_ADC_U_ADC_DRIVER2#1.3), U1_ADC/U_ADC_DRIVER3 (R?_U1_ADC_U_ADC_DRIVER3#1.1 U?_U1_ADC_U_ADC_DRIVER3#1.3), U1_ADC/U_ADC_DRIVER4 (R?_U1_ADC_U_ADC_DRIVER4#1.1 U?_U1_ADC_U_ADC_DRIVER4#1.3), U1_ADC/U_ADC_DRIVER5 (R?_U1_ADC_U_ADC_DRIVER5#1.1 U?_U1_ADC_U_ADC_DRIVER5#1.3), U1_ADC/U_ADC_DRIVER6 (R?_U1_ADC_U_ADC_DRIVER6#1.1 U?_U1_ADC_U_ADC_DRIVER6#1.3), U1_ADC/U_ADC_DRIVER7 (R?_U1_ADC_U_ADC_DRIVER7#1.1 U?_U1_ADC_U_ADC_DRIVER7#1.3), U1_ADC/U_ADC_DRIVER8 (R?_U1_ADC_U_ADC_DRIVER8#1.1 U?_U1_ADC_U_ADC_DRIVER8#1.3), U2_ADC/U_ADC_DRIVER1 (R?_U2_ADC_U_ADC_DRIVER1#1.1 U?_U2_ADC_U_ADC_DRIVER1#1.3), U2_ADC/U_ADC_DRIVER2 (R?_U2_ADC_U_ADC_DRIVER2#1.1 U?_U2_ADC_U_ADC_DRIVER2#1.3), U2_ADC/U_ADC_DRIVER3 (R?_U2_ADC_U_ADC_DRIVER3#1.1 U?_U2_ADC_U_ADC_DRIVER3#1.3), U2_ADC/U_ADC_DRIVER4 (R?_U2_ADC_U_ADC_DRIVER4#1.1 U?_U2_ADC_U_ADC_DRIVER4#1.3), U2_ADC/U_ADC_DRIVER5 (R?_U2_ADC_U_ADC_DRIVER5#1.1 U?_U2_ADC_U_ADC_DRIVER5#1.3), U2_ADC/U_ADC_DRIVER6 (R?_U2_ADC_U_ADC_DRIVER6#1.1 U?_U2_ADC_U_ADC_DRIVER6#1.3), U2_ADC/U_ADC_DRIVER7 (R?_U2_ADC_U_ADC_DRIVER7#1.1 U?_U2_ADC_U_ADC_DRIVER7#1.3), U2_ADC/U_ADC_DRIVER8 (R?_U2_ADC_U_ADC_DRIVER8#1.1 U?_U2_ADC_U_ADC_DRIVER8#1.3), U3_ADC/U_ADC_DRIVER1 (R?_U3_ADC_U_ADC_DRIVER1#1.1 U?_U3_ADC_U_ADC_DRIVER1#1.3), U3_ADC/U_ADC_DRIVER2 (R?_U3_ADC_U_ADC_DRIVER2#1.1 U?_U3_ADC_U_ADC_DRIVER2#1.3), U3_ADC/U_ADC_DRIVER3 (R?_U3_ADC_U_ADC_DRIVER3#1.1 U?_U3_ADC_U_ADC_DRIVER3#1.3), U3_ADC/U_ADC_DRIVER4 (R?_U3_ADC_U_ADC_DRIVER4#1.1 U?_U3_ADC_U_ADC_DRIVER4#1.3), U3_ADC/U_ADC_DRIVER5 (R?_U3_ADC_U_ADC_DRIVER5#1.1 U?_U3_ADC_U_ADC_DRIVER5#1.3), U3_ADC/U_ADC_DRIVER6 (R?_U3_ADC_U_ADC_DRIVER6#1.1 U?_U3_ADC_U_ADC_DRIVER6#1.3), U3_ADC/U_ADC_DRIVER7 (R?_U3_ADC_U_ADC_DRIVER7#1.1 U?_U3_ADC_U_ADC_DRIVER7#1.3), U3_ADC/U_ADC_DRIVER8 (R?_U3_ADC_U_ADC_DRIVER8#1.1 U?_U3_ADC_U_ADC_DRIVER8#1.3), U4_ADC/U_ADC_DRIVER1 (R?_U4_ADC_U_ADC_DRIVER1#1.1 U?_U4_ADC_U_ADC_DRIVER1#1.3), U4_ADC/U_ADC_DRIVER2 (R?_U4_ADC_U_ADC_DRIVER2#1.1 U?_U4_ADC_U_ADC_DRIVER2#1.3), U4_ADC/U_ADC_DRIVER3 (R?_U4_ADC_U_ADC_DRIVER3#1.1 U?_U4_ADC_U_ADC_DRIVER3#1.3), U4_ADC/U_ADC_DRIVER4 (R?_U4_ADC_U_ADC_DRIVER4#1.1 U?_U4_ADC_U_ADC_DRIVER4#1.3), U4_ADC/U_ADC_DRIVER5 (R?_U4_ADC_U_ADC_DRIVER5#1.1 U?_U4_ADC_U_ADC_DRIVER5#1.3), U4_ADC/U_ADC_DRIVER6 (R?_U4_ADC_U_ADC_DRIVER6#1.1 U?_U4_ADC_U_ADC_DRIVER6#1.3), U4_ADC/U_ADC_DRIVER7 (R?_U4_ADC_U_ADC_DRIVER7#1.1 U?_U4_ADC_U_ADC_DRIVER7#1.3), U4_ADC/U_ADC_DRIVER8 (R?_U4_ADC_U_ADC_DRIVER8#1.1 U?_U4_ADC_U_ADC_DRIVER8#1.3), U5_ADC/U_ADC_DRIVER1 (R?_U5_ADC_U_ADC_DRIVER1#1.1 U?_U5_ADC_U_ADC_DRIVER1#1.3), U5_ADC/U_ADC_DRIVER2 (R?_U5_ADC_U_ADC_DRIVER2#1.1 U?_U5_ADC_U_ADC_DRIVER2#1.3), U5_ADC/U_ADC_DRIVER3 (R?_U5_ADC_U_ADC_DRIVER3#1.1 U?_U5_ADC_U_ADC_DRIVER3#1.3), U5_ADC/U_ADC_DRIVER4 (R?_U5_ADC_U_ADC_DRIVER4#1.1 U?_U5_ADC_U_ADC_DRIVER4#1.3), U5_ADC/U_ADC_DRIVER5 (R?_U5_ADC_U_ADC_DRIVER5#1.1 U?_U5_ADC_U_ADC_DRIVER5#1.3), U5_ADC/U_ADC_DRIVER6 (R?_U5_ADC_U_ADC_DRIVER6#1.1 U?_U5_ADC_U_ADC_DRIVER6#1.3), U5_ADC/U_ADC_DRIVER7 (R?_U5_ADC_U_ADC_DRIVER7#1.1 U?_U5_ADC_U_ADC_DRIVER7#1.3), U5_ADC/U_ADC_DRIVER8 (R?_U5_ADC_U_ADC_DRIVER8#1.1 U?_U5_ADC_U_ADC_DRIVER8#1.3)
12V: Power-AW1 (12 pins), AI_CONN (8 pins)
+5: U1_ADC (14 pins), U2_ADC (14 pins), U3_ADC (14 pins), U4_ADC (14 pins), U5_ADC (14 pins)
+5V: U1_ADC (C20_U1_ADC.2 C21_U1_ADC.2 U4_U1_ADC.2), U2_ADC (C20_U2_ADC.2 C21_U2_ADC.2 U4_U2_ADC.2), U3_ADC (C20_U3_ADC.2 C21_U3_ADC.2 U4_U3_ADC.2), U4_ADC (C20_U4_ADC.2 C21_U4_ADC.2 U4_U4_ADC.2), U5_ADC (C20_U5_ADC.2 C21_U5_ADC.2 U4_U5_ADC.2)
GND: Landing-AW1 (M?#1.1 M?#2.1 M?#3.1 M?#4.1), U1_ADC (39 pins), U1_ADC/U_ADC_DRIVER1 (9 pins), U1_ADC/U_ADC_DRIVER2 (9 pins), U1_ADC/U_ADC_DRIVER3 (9 pins), U1_ADC/U_ADC_DRIVER4 (9 pins), U1_ADC/U_ADC_DRIVER5 (9 pins), U1_ADC/U_ADC_DRIVER6 (9 pins), U1_ADC/U_ADC_DRIVER7 (9 pins), U1_ADC/U_ADC_DRIVER8 (9 pins), Power-AW1 (52 pins), U2_ADC (39 pins), U2_ADC/U_ADC_DRIVER1 (9 pins), U2_ADC/U_ADC_DRIVER2 (9 pins), U2_ADC/U_ADC_DRIVER3 (9 pins), U2_ADC/U_ADC_DRIVER4 (9 pins), U2_ADC/U_ADC_DRIVER5 (9 pins), U2_ADC/U_ADC_DRIVER6 (9 pins), U2_ADC/U_ADC_DRIVER7 (9 pins), U2_ADC/U_ADC_DRIVER8 (9 pins), U3_ADC (39 pins), U3_ADC/U_ADC_DRIVER1 (9 pins), U3_ADC/U_ADC_DRIVER2 (9 pins), U3_ADC/U_ADC_DRIVER3 (9 pins), U3_ADC/U_ADC_DRIVER4 (9 pins), U3_ADC/U_ADC_DRIVER5 (9 pins), U3_ADC/U_ADC_DRIVER6 (9 pins), U3_ADC/U_ADC_DRIVER7 (9 pins), U3_ADC/U_ADC_DRIVER8 (9 pins), U4_ADC (39 pins), U4_ADC/U_ADC_DRIVER1 (9 pins), U4_ADC/U_ADC_DRIVER2 (9 pins), U4_ADC/U_ADC_DRIVER3 (9 pins), U4_ADC/U_ADC_DRIVER4 (9 pins), U4_ADC/U_ADC_DRIVER5 (9 pins), U4_ADC/U_ADC_DRIVER6 (9 pins), U4_ADC/U_ADC_DRIVER7 (9 pins), U4_ADC/U_ADC_DRIVER8 (9 pins), U5_ADC (39 pins), U5_ADC/U_ADC_DRIVER1 (9 pins), U5_ADC/U_ADC_DRIVER2 (9 pins), U5_ADC/U_ADC_DRIVER3 (9 pins), U5_ADC/U_ADC_DRIVER4 (9 pins), U5_ADC/U_ADC_DRIVER5 (9 pins), U5_ADC/U_ADC_DRIVER6 (9 pins), U5_ADC/U_ADC_DRIVER7 (9 pins), U5_ADC/U_ADC_DRIVER8 (9 pins), AI_CONN (37 pins)
VCM_U1_ADC: U1_ADC (6 pins), U1_ADC/U_ADC_DRIVER1 (C?_U1_ADC_U_ADC_DRIVER1#2.2 R?_U1_ADC_U_ADC_DRIVER1#6.0 R?_U1_ADC_U_ADC_DRIVER1#9.1 U?_U1_ADC_U_ADC_DRIVER1#3.2), U1_ADC/U_ADC_DRIVER2 (C?_U1_ADC_U_ADC_DRIVER2#2.2 R?_U1_ADC_U_ADC_DRIVER2#6.0 R?_U1_ADC_U_ADC_DRIVER2#9.1 U?_U1_ADC_U_ADC_DRIVER2#3.2), U1_ADC/U_ADC_DRIVER3 (C?_U1_ADC_U_ADC_DRIVER3#2.2 R?_U1_ADC_U_ADC_DRIVER3#6.0 R?_U1_ADC_U_ADC_DRIVER3#9.1 U?_U1_ADC_U_ADC_DRIVER3#3.2), U1_ADC/U_ADC_DRIVER4 (C?_U1_ADC_U_ADC_DRIVER4#2.2 R?_U1_ADC_U_ADC_DRIVER4#6.0 R?_U1_ADC_U_ADC_DRIVER4#9.1 U?_U1_ADC_U_ADC_DRIVER4#3.2), U1_ADC/U_ADC_DRIVER5 (C?_U1_ADC_U_ADC_DRIVER5#2.2 R?_U1_ADC_U_ADC_DRIVER5#6.0 R?_U1_ADC_U_ADC_DRIVER5#9.1 U?_U1_ADC_U_ADC_DRIVER5#3.2), U1_ADC/U_ADC_DRIVER6 (C?_U1_ADC_U_ADC_DRIVER6#2.2 R?_U1_ADC_U_ADC_DRIVER6#6.0 R?_U1_ADC_U_ADC_DRIVER6#9.1 U?_U1_ADC_U_ADC_DRIVER6#3.2), U1_ADC/U_ADC_DRIVER7 (C?_U1_ADC_U_ADC_DRIVER7#2.2 R?_U1_ADC_U_ADC_DRIVER7#6.0 R?_U1_ADC_U_ADC_DRIVER7#9.1 U?_U1_ADC_U_ADC_DRIVER7#3.2), U1_ADC/U_ADC_DRIVER8 (C?_U1_ADC_U_ADC_DRIVER8#2.2 R?_U1_ADC_U_ADC_DRIVER8#6.0 R?_U1_ADC_U_ADC_DRIVER8#9.1 U?_U1_ADC_U_ADC_DRIVER8#3.2)
VCM_U2_ADC: U2_ADC (6 pins), U2_ADC/U_ADC_DRIVER1 (C?_U2_ADC_U_ADC_DRIVER1#2.2 R?_U2_ADC_U_ADC_DRIVER1#6.0 R?_U2_ADC_U_ADC_DRIVER1#9.1 U?_U2_ADC_U_ADC_DRIVER1#3.2), U2_ADC/U_ADC_DRIVER2 (C?_U2_ADC_U_ADC_DRIVER2#2.2 R?_U2_ADC_U_ADC_DRIVER2#6.0 R?_U2_ADC_U_ADC_DRIVER2#9.1 U?_U2_ADC_U_ADC_DRIVER2#3.2), U2_ADC/U_ADC_DRIVER3 (C?_U2_ADC_U_ADC_DRIVER3#2.2 R?_U2_ADC_U_ADC_DRIVER3#6.0 R?_U2_ADC_U_ADC_DRIVER3#9.1 U?_U2_ADC_U_ADC_DRIVER3#3.2), U2_ADC/U_ADC_DRIVER4 (C?_U2_ADC_U_ADC_DRIVER4#2.2 R?_U2_ADC_U_ADC_DRIVER4#6.0 R?_U2_ADC_U_ADC_DRIVER4#9.1 U?_U2_ADC_U_ADC_DRIVER4#3.2), U2_ADC/U_ADC_DRIVER5 (C?_U2_ADC_U_ADC_DRIVER5#2.2 R?_U2_ADC_U_ADC_DRIVER5#6.0 R?_U2_ADC_U_ADC_DRIVER5#9.1 U?_U2_ADC_U_ADC_DRIVER5#3.2), U2_ADC/U_ADC_DRIVER6 (C?_U2_ADC_U_ADC_DRIVER6#2.2 R?_U2_ADC_U_ADC_DRIVER6#6.0 R?_U2_ADC_U_ADC_DRIVER6#9.1 U?_U2_ADC_U_ADC_DRIVER6#3.2), U2_ADC/U_ADC_DRIVER7 (C?_U2_ADC_U_ADC_DRIVER7#2.2 R?_U2_ADC_U_ADC_DRIVER7#6.0 R?_U2_ADC_U_ADC_DRIVER7#9.1 U?_U2_ADC_U_ADC_DRIVER7#3.2), U2_ADC/U_ADC_DRIVER8 (C?_U2_ADC_U_ADC_DRIVER8#2.2 R?_U2_ADC_U_ADC_DRIVER8#6.0 R?_U2_ADC_U_ADC_DRIVER8#9.1 U?_U2_ADC_U_ADC_DRIVER8#3.2)
VCM_U3_ADC: U3_ADC (6 pins), U3_ADC/U_ADC_DRIVER1 (C?_U3_ADC_U_ADC_DRIVER1#2.2 R?_U3_ADC_U_ADC_DRIVER1#6.0 R?_U3_ADC_U_ADC_DRIVER1#9.1 U?_U3_ADC_U_ADC_DRIVER1#3.2), U3_ADC/U_ADC_DRIVER2 (C?_U3_ADC_U_ADC_DRIVER2#2.2 R?_U3_ADC_U_ADC_DRIVER2#6.0 R?_U3_ADC_U_ADC_DRIVER2#9.1 U?_U3_ADC_U_ADC_DRIVER2#3.2), U3_ADC/U_ADC_DRIVER3 (C?_U3_ADC_U_ADC_DRIVER3#2.2 R?_U3_ADC_U_ADC_DRIVER3#6.0 R?_U3_ADC_U_ADC_DRIVER3#9.1 U?_U3_ADC_U_ADC_DRIVER3#3.2), U3_ADC/U_ADC_DRIVER4 (C?_U3_ADC_U_ADC_DRIVER4#2.2 R?_U3_ADC_U_ADC_DRIVER4#6.0 R?_U3_ADC_U_ADC_DRIVER4#9.1 U?_U3_ADC_U_ADC_DRIVER4#3.2), U3_ADC/U_ADC_DRIVER5 (C?_U3_ADC_U_ADC_DRIVER5#2.2 R?_U3_ADC_U_ADC_DRIVER5#6.0 R?_U3_ADC_U_ADC_DRIVER5#9.1 U?_U3_ADC_U_ADC_DRIVER5#3.2), U3_ADC/U_ADC_DRIVER6 (C?_U3_ADC_U_ADC_DRIVER6#2.2 R?_U3_ADC_U_ADC_DRIVER6#6.0 R?_U3_ADC_U_ADC_DRIVER6#9.1 U?_U3_ADC_U_ADC_DRIVER6#3.2), U3_ADC/U_ADC_DRIVER7 (C?_U3_ADC_U_ADC_DRIVER7#2.2 R?_U3_ADC_U_ADC_DRIVER7#6.0 R?_U3_ADC_U_ADC_DRIVER7#9.1 U?_U3_ADC_U_ADC_DRIVER7#3.2), U3_ADC/U_ADC_DRIVER8 (C?_U3_ADC_U_ADC_DRIVER8#2.2 R?_U3_ADC_U_ADC_DRIVER8#6.0 R?_U3_ADC_U_ADC_DRIVER8#9.1 U?_U3_ADC_U_ADC_DRIVER8#3.2)
VCM_U4_ADC: U4_ADC (6 pins), U4_ADC/U_ADC_DRIVER1 (C?_U4_ADC_U_ADC_DRIVER1#2.2 R?_U4_ADC_U_ADC_DRIVER1#6.0 R?_U4_ADC_U_ADC_DRIVER1#9.1 U?_U4_ADC_U_ADC_DRIVER1#3.2), U4_ADC/U_ADC_DRIVER2 (C?_U4_ADC_U_ADC_DRIVER2#2.2 R?_U4_ADC_U_ADC_DRIVER2#6.0 R?_U4_ADC_U_ADC_DRIVER2#9.1 U?_U4_ADC_U_ADC_DRIVER2#3.2), U4_ADC/U_ADC_DRIVER3 (C?_U4_ADC_U_ADC_DRIVER3#2.2 R?_U4_ADC_U_ADC_DRIVER3#6.0 R?_U4_ADC_U_ADC_DRIVER3#9.1 U?_U4_ADC_U_ADC_DRIVER3#3.2), U4_ADC/U_ADC_DRIVER4 (C?_U4_ADC_U_ADC_DRIVER4#2.2 R?_U4_ADC_U_ADC_DRIVER4#6.0 R?_U4_ADC_U_ADC_DRIVER4#9.1 U?_U4_ADC_U_ADC_DRIVER4#3.2), U4_ADC/U_ADC_DRIVER5 (C?_U4_ADC_U_ADC_DRIVER5#2.2 R?_U4_ADC_U_ADC_DRIVER5#6.0 R?_U4_ADC_U_ADC_DRIVER5#9.1 U?_U4_ADC_U_ADC_DRIVER5#3.2), U4_ADC/U_ADC_DRIVER6 (C?_U4_ADC_U_ADC_DRIVER6#2.2 R?_U4_ADC_U_ADC_DRIVER6#6.0 R?_U4_ADC_U_ADC_DRIVER6#9.1 U?_U4_ADC_U_ADC_DRIVER6#3.2), U4_ADC/U_ADC_DRIVER7 (C?_U4_ADC_U_ADC_DRIVER7#2.2 R?_U4_ADC_U_ADC_DRIVER7#6.0 R?_U4_ADC_U_ADC_DRIVER7#9.1 U?_U4_ADC_U_ADC_DRIVER7#3.2), U4_ADC/U_ADC_DRIVER8 (C?_U4_ADC_U_ADC_DRIVER8#2.2 R?_U4_ADC_U_ADC_DRIVER8#6.0 R?_U4_ADC_U_ADC_DRIVER8#9.1 U?_U4_ADC_U_ADC_DRIVER8#3.2)
VCM_U5_ADC: U5_ADC (6 pins), U5_ADC/U_ADC_DRIVER1 (C?_U5_ADC_U_ADC_DRIVER1#2.2 R?_U5_ADC_U_ADC_DRIVER1#6.0 R?_U5_ADC_U_ADC_DRIVER1#9.1 U?_U5_ADC_U_ADC_DRIVER1#3.2), U5_ADC/U_ADC_DRIVER2 (C?_U5_ADC_U_ADC_DRIVER2#2.2 R?_U5_ADC_U_ADC_DRIVER2#6.0 R?_U5_ADC_U_ADC_DRIVER2#9.1 U?_U5_ADC_U_ADC_DRIVER2#3.2), U5_ADC/U_ADC_DRIVER3 (C?_U5_ADC_U_ADC_DRIVER3#2.2 R?_U5_ADC_U_ADC_DRIVER3#6.0 R?_U5_ADC_U_ADC_DRIVER3#9.1 U?_U5_ADC_U_ADC_DRIVER3#3.2), U5_ADC/U_ADC_DRIVER4 (C?_U5_ADC_U_ADC_DRIVER4#2.2 R?_U5_ADC_U_ADC_DRIVER4#6.0 R?_U5_ADC_U_ADC_DRIVER4#9.1 U?_U5_ADC_U_ADC_DRIVER4#3.2), U5_ADC/U_ADC_DRIVER5 (C?_U5_ADC_U_ADC_DRIVER5#2.2 R?_U5_ADC_U_ADC_DRIVER5#6.0 R?_U5_ADC_U_ADC_DRIVER5#9.1 U?_U5_ADC_U_ADC_DRIVER5#3.2), U5_ADC/U_ADC_DRIVER6 (C?_U5_ADC_U_ADC_DRIVER6#2.2 R?_U5_ADC_U_ADC_DRIVER6#6.0 R?_U5_ADC_U_ADC_DRIVER6#9.1 U?_U5_ADC_U_ADC_DRIVER6#3.2), U5_ADC/U_ADC_DRIVER7 (C?_U5_ADC_U_ADC_DRIVER7#2.2 R?_U5_ADC_U_ADC_DRIVER7#6.0 R?_U5_ADC_U_ADC_DRIVER7#9.1 U?_U5_ADC_U_ADC_DRIVER7#3.2), U5_ADC/U_ADC_DRIVER8 (C?_U5_ADC_U_ADC_DRIVER8#2.2 R?_U5_ADC_U_ADC_DRIVER8#6.0 R?_U5_ADC_U_ADC_DRIVER8#9.1 U?_U5_ADC_U_ADC_DRIVER8#3.2)
VOutA_N1_U1_ADC: U1_ADC (U1_U1_ADC.64), U1_ADC/U_ADC_DRIVER1 (C36_U1_ADC_U_ADC_DRIVER1.1 C39_U1_ADC_U_ADC_DRIVER1.2 R11_U1_ADC_U_ADC_DRIVER1.1)
VOutA_N1_U2_ADC: U2_ADC (U1_U2_ADC.64), U2_ADC/U_ADC_DRIVER1 (C36_U2_ADC_U_ADC_DRIVER1.1 C39_U2_ADC_U_ADC_DRIVER1.2 R11_U2_ADC_U_ADC_DRIVER1.1)
VOutA_N1_U3_ADC: U3_ADC (U1_U3_ADC.64), U3_ADC/U_ADC_DRIVER1 (C36_U3_ADC_U_ADC_DRIVER1.1 C39_U3_ADC_U_ADC_DRIVER1.2 R11_U3_ADC_U_ADC_DRIVER1.1)
VOutA_N1_U4_ADC: U4_ADC (U1_U4_ADC.64), U4_ADC/U_ADC_DRIVER1 (C36_U4_ADC_U_ADC_DRIVER1.1 C39_U4_ADC_U_ADC_DRIVER1.2 R11_U4_ADC_U_ADC_DRIVER1.1)
VOutA_N1_U5_ADC: U5_ADC (U1_U5_ADC.64), U5_ADC/U_ADC_DRIVER1 (C36_U5_ADC_U_ADC_DRIVER1.1 C39_U5_ADC_U_ADC_DRIVER1.2 R11_U5_ADC_U_ADC_DRIVER1.1)
VOutA_N2_U1_ADC: U1_ADC (U1_U1_ADC.8), U1_ADC/U_ADC_DRIVER2 (C36_U1_ADC_U_ADC_DRIVER2.1 C39_U1_ADC_U_ADC_DRIVER2.2 R11_U1_ADC_U_ADC_DRIVER2.1)
VOutA_N2_U2_ADC: U2_ADC (U1_U2_ADC.8), U2_ADC/U_ADC_DRIVER2 (C36_U2_ADC_U_ADC_DRIVER2.1 C39_U2_ADC_U_ADC_DRIVER2.2 R11_U2_ADC_U_ADC_DRIVER2.1)
VOutA_N2_U3_ADC: U3_ADC (U1_U3_ADC.8), U3_ADC/U_ADC_DRIVER2 (C36_U3_ADC_U_ADC_DRIVER2.1 C39_U3_ADC_U_ADC_DRIVER2.2 R11_U3_ADC_U_ADC_DRIVER2.1)
VOutA_N2_U4_ADC: U4_ADC (U1_U4_ADC.8), U4_ADC/U_ADC_DRIVER2 (C36_U4_ADC_U_ADC_DRIVER2.1 C39_U4_ADC_U_ADC_DRIVER2.2 R11_U4_ADC_U_ADC_DRIVER2.1)
VOutA_N2_U5_ADC: U5_ADC (U1_U5_ADC.8), U5_ADC/U_ADC_DRIVER2 (C36_U5_ADC_U_ADC_DRIVER2.1 C39_U5_ADC_U_ADC_DRIVER2.2 R11_U5_ADC_U_ADC_DRIVER2.1)
VOutA_N3_U1_ADC: U1_ADC (U1_U1_ADC.49), U1_ADC/U_ADC_DRIVER3 (C36_U1_ADC_U_ADC_DRIVER3.1 C39_U1_ADC_U_ADC_DRIVER3.2 R11_U1_ADC_U_ADC_DRIVER3.1)
VOutA_N3_U2_ADC: U2_ADC (U1_U2_ADC.49), U2_ADC/U_ADC_DRIVER3 (C36_U2_ADC_U_ADC_DRIVER3.1 C39_U2_ADC_U_ADC_DRIVER3.2 R11_U2_ADC_U_ADC_DRIVER3.1)
VOutA_N3_U3_ADC: U3_ADC (U1_U3_ADC.49), U3_ADC/U_ADC_DRIVER3 (C36_U3_ADC_U_ADC_DRIVER3.1 C39_U3_ADC_U_ADC_DRIVER3.2 R11_U3_ADC_U_ADC_DRIVER3.1)
VOutA_N3_U4_ADC: U4_ADC (U1_U4_ADC.49), U4_ADC/U_ADC_DRIVER3 (C36_U4_ADC_U_ADC_DRIVER3.1 C39_U4_ADC_U_ADC_DRIVER3.2 R11_U4_ADC_U_ADC_DRIVER3.1)
VOutA_N3_U5_ADC: U5_ADC (U1_U5_ADC.49), U5_ADC/U_ADC_DRIVER3 (C36_U5_ADC_U_ADC_DRIVER3.1 C39_U5_ADC_U_ADC_DRIVER3.2 R11_U5_ADC_U_ADC_DRIVER3.1)
VOutA_N4_U1_ADC: U1_ADC (U1_U1_ADC.42), U1_ADC/U_ADC_DRIVER4 (C36_U1_ADC_U_ADC_DRIVER4.1 C39_U1_ADC_U_ADC_DRIVER4.2 R11_U1_ADC_U_ADC_DRIVER4.1)
VOutA_N4_U2_ADC: U2_ADC (U1_U2_ADC.42), U2_ADC/U_ADC_DRIVER4 (C36_U2_ADC_U_ADC_DRIVER4.1 C39_U2_ADC_U_ADC_DRIVER4.2 R11_U2_ADC_U_ADC_DRIVER4.1)
VOutA_N4_U3_ADC: U3_ADC (U1_U3_ADC.42), U3_ADC/U_ADC_DRIVER4 (C36_U3_ADC_U_ADC_DRIVER4.1 C39_U3_ADC_U_ADC_DRIVER4.2 R11_U3_ADC_U_ADC_DRIVER4.1)
VOutA_N4_U4_ADC: U4_ADC (U1_U4_ADC.42), U4_ADC/U_ADC_DRIVER4 (C36_U4_ADC_U_ADC_DRIVER4.1 C39_U4_ADC_U_ADC_DRIVER4.2 R11_U4_ADC_U_ADC_DRIVER4.1)
VOutA_N4_U5_ADC: U5_ADC (U1_U5_ADC.42), U5_ADC/U_ADC_DRIVER4 (C36_U5_ADC_U_ADC_DRIVER4.1 C39_U5_ADC_U_ADC_DRIVER4.2 R11_U5_ADC_U_ADC_DRIVER4.1)
VOutA_P1_U1_ADC: U1_ADC (U1_U1_ADC.63), U1_ADC/U_ADC_DRIVER1 (C36_U1_ADC_U_ADC_DRIVER1.2 C40_U1_ADC_U_ADC_DRIVER1.2 R6_U1_ADC_U_ADC_DRIVER1.1)
VOutA_P1_U2_ADC: U2_ADC (U1_U2_ADC.63), U2_ADC/U_ADC_DRIVER1 (C36_U2_ADC_U_ADC_DRIVER1.2 C40_U2_ADC_U_ADC_DRIVER1.2 R6_U2_ADC_U_ADC_DRIVER1.1)
VOutA_P1_U3_ADC: U3_ADC (U1_U3_ADC.63), U3_ADC/U_ADC_DRIVER1 (C36_U3_ADC_U_ADC_DRIVER1.2 C40_U3_ADC_U_ADC_DRIVER1.2 R6_U3_ADC_U_ADC_DRIVER1.1)
VOutA_P1_U4_ADC: U4_ADC (U1_U4_ADC.63), U4_ADC/U_ADC_DRIVER1 (C36_U4_ADC_U_ADC_DRIVER1.2 C40_U4_ADC_U_ADC_DRIVER1.2 R6_U4_ADC_U_ADC_DRIVER1.1)
VOutA_P1_U5_ADC: U5_ADC (U1_U5_ADC.63), U5_ADC/U_ADC_DRIVER1 (C36_U5_ADC_U_ADC_DRIVER1.2 C40_U5_ADC_U_ADC_DRIVER1.2 R6_U5_ADC_U_ADC_DRIVER1.1)
VOutA_P2_U1_ADC: U1_ADC (U1_U1_ADC.7), U1_ADC/U_ADC_DRIVER2 (C36_U1_ADC_U_ADC_DRIVER2.2 C40_U1_ADC_U_ADC_DRIVER2.2 R6_U1_ADC_U_ADC_DRIVER2.1)
VOutA_P2_U2_ADC: U2_ADC (U1_U2_ADC.7), U2_ADC/U_ADC_DRIVER2 (C36_U2_ADC_U_ADC_DRIVER2.2 C40_U2_ADC_U_ADC_DRIVER2.2 R6_U2_ADC_U_ADC_DRIVER2.1)
VOutA_P2_U3_ADC: U3_ADC (U1_U3_ADC.7), U3_ADC/U_ADC_DRIVER2 (C36_U3_ADC_U_ADC_DRIVER2.2 C40_U3_ADC_U_ADC_DRIVER2.2 R6_U3_ADC_U_ADC_DRIVER2.1)
VOutA_P2_U4_ADC: U4_ADC (U1_U4_ADC.7), U4_ADC/U_ADC_DRIVER2 (C36_U4_ADC_U_ADC_DRIVER2.2 C40_U4_ADC_U_ADC_DRIVER2.2 R6_U4_ADC_U_ADC_DRIVER2.1)
VOutA_P2_U5_ADC: U5_ADC (U1_U5_ADC.7), U5_ADC/U_ADC_DRIVER2 (C36_U5_ADC_U_ADC_DRIVER2.2 C40_U5_ADC_U_ADC_DRIVER2.2 R6_U5_ADC_U_ADC_DRIVER2.1)
VOutA_P3_U1_ADC: U1_ADC (U1_U1_ADC.50), U1_ADC/U_ADC_DRIVER3 (C36_U1_ADC_U_ADC_DRIVER3.2 C40_U1_ADC_U_ADC_DRIVER3.2 R6_U1_ADC_U_ADC_DRIVER3.1)
VOutA_P3_U2_ADC: U2_ADC (U1_U2_ADC.50), U2_ADC/U_ADC_DRIVER3 (C36_U2_ADC_U_ADC_DRIVER3.2 C40_U2_ADC_U_ADC_DRIVER3.2 R6_U2_ADC_U_ADC_DRIVER3.1)
VOutA_P3_U3_ADC: U3_ADC (U1_U3_ADC.50), U3_ADC/U_ADC_DRIVER3 (C36_U3_ADC_U_ADC_DRIVER3.2 C40_U3_ADC_U_ADC_DRIVER3.2 R6_U3_ADC_U_ADC_DRIVER3.1)
VOutA_P3_U4_ADC: U4_ADC (U1_U4_ADC.50), U4_ADC/U_ADC_DRIVER3 (C36_U4_ADC_U_ADC_DRIVER3.2 C40_U4_ADC_U_ADC_DRIVER3.2 R6_U4_ADC_U_ADC_DRIVER3.1)
VOutA_P3_U5_ADC: U5_ADC (U1_U5_ADC.50), U5_ADC/U_ADC_DRIVER3 (C36_U5_ADC_U_ADC_DRIVER3.2 C40_U5_ADC_U_ADC_DRIVER3.2 R6_U5_ADC_U_ADC_DRIVER3.1)
VOutA_P4_U1_ADC: U1_ADC (U1_U1_ADC.41), U1_ADC/U_ADC_DRIVER4 (C36_U1_ADC_U_ADC_DRIVER4.2 C40_U1_ADC_U_ADC_DRIVER4.2 R6_U1_ADC_U_ADC_DRIVER4.1)
VOutA_P4_U2_ADC: U2_ADC (U1_U2_ADC.41), U2_ADC/U_ADC_DRIVER4 (C36_U2_ADC_U_ADC_DRIVER4.2 C40_U2_ADC_U_ADC_DRIVER4.2 R6_U2_ADC_U_ADC_DRIVER4.1)
VOutA_P4_U3_ADC: U3_ADC (U1_U3_ADC.41), U3_ADC/U_ADC_DRIVER4 (C36_U3_ADC_U_ADC_DRIVER4.2 C40_U3_ADC_U_ADC_DRIVER4.2 R6_U3_ADC_U_ADC_DRIVER4.1)
VOutA_P4_U4_ADC: U4_ADC (U1_U4_ADC.41), U4_ADC/U_ADC_DRIVER4 (C36_U4_ADC_U_ADC_DRIVER4.2 C40_U4_ADC_U_ADC_DRIVER4.2 R6_U4_ADC_U_ADC_DRIVER4.1)
VOutA_P4_U5_ADC: U5_ADC (U1_U5_ADC.41), U5_ADC/U_ADC_DRIVER4 (C36_U5_ADC_U_ADC_DRIVER4.2 C40_U5_ADC_U_ADC_DRIVER4.2 R6_U5_ADC_U_ADC_DRIVER4.1)
VOutB_N1_U1_ADC: U1_ADC (U1_U1_ADC.2), U1_ADC/U_ADC_DRIVER1 (R?_U1_ADC_U_ADC_DRIVER1#16.0)
VOutB_N1_U2_ADC: U2_ADC (U1_U2_ADC.2), U2_ADC/U_ADC_DRIVER1 (R?_U2_ADC_U_ADC_DRIVER1#16.0)
VOutB_N1_U3_ADC: U3_ADC (U1_U3_ADC.2), U3_ADC/U_ADC_DRIVER1 (R?_U3_ADC_U_ADC_DRIVER1#16.0)
VOutB_N1_U4_ADC: U4_ADC (U1_U4_ADC.2), U4_ADC/U_ADC_DRIVER1 (R?_U4_ADC_U_ADC_DRIVER1#16.0)
VOutB_N1_U5_ADC: U5_ADC (U1_U5_ADC.2), U5_ADC/U_ADC_DRIVER1 (R?_U5_ADC_U_ADC_DRIVER1#16.0)
VOutB_P1_U1_ADC: U1_ADC (U1_U1_ADC.1), U1_ADC/U_ADC_DRIVER1 (R?_U1_ADC_U_ADC_DRIVER1#14.0)
VOutB_P1_U2_ADC: U2_ADC (U1_U2_ADC.1), U2_ADC/U_ADC_DRIVER1 (R?_U2_ADC_U_ADC_DRIVER1#14.0)
VOutB_P1_U3_ADC: U3_ADC (U1_U3_ADC.1), U3_ADC/U_ADC_DRIVER1 (R?_U3_ADC_U_ADC_DRIVER1#14.0)
VOutB_P1_U4_ADC: U4_ADC (U1_U4_ADC.1), U4_ADC/U_ADC_DRIVER1 (R?_U4_ADC_U_ADC_DRIVER1#14.0)
VOutB_P1_U5_ADC: U5_ADC (U1_U5_ADC.1), U5_ADC/U_ADC_DRIVER1 (R?_U5_ADC_U_ADC_DRIVER1#14.0)